# Altium project RbMotor_ECAT_RevB+.PrjPcb (part 1 of 2)
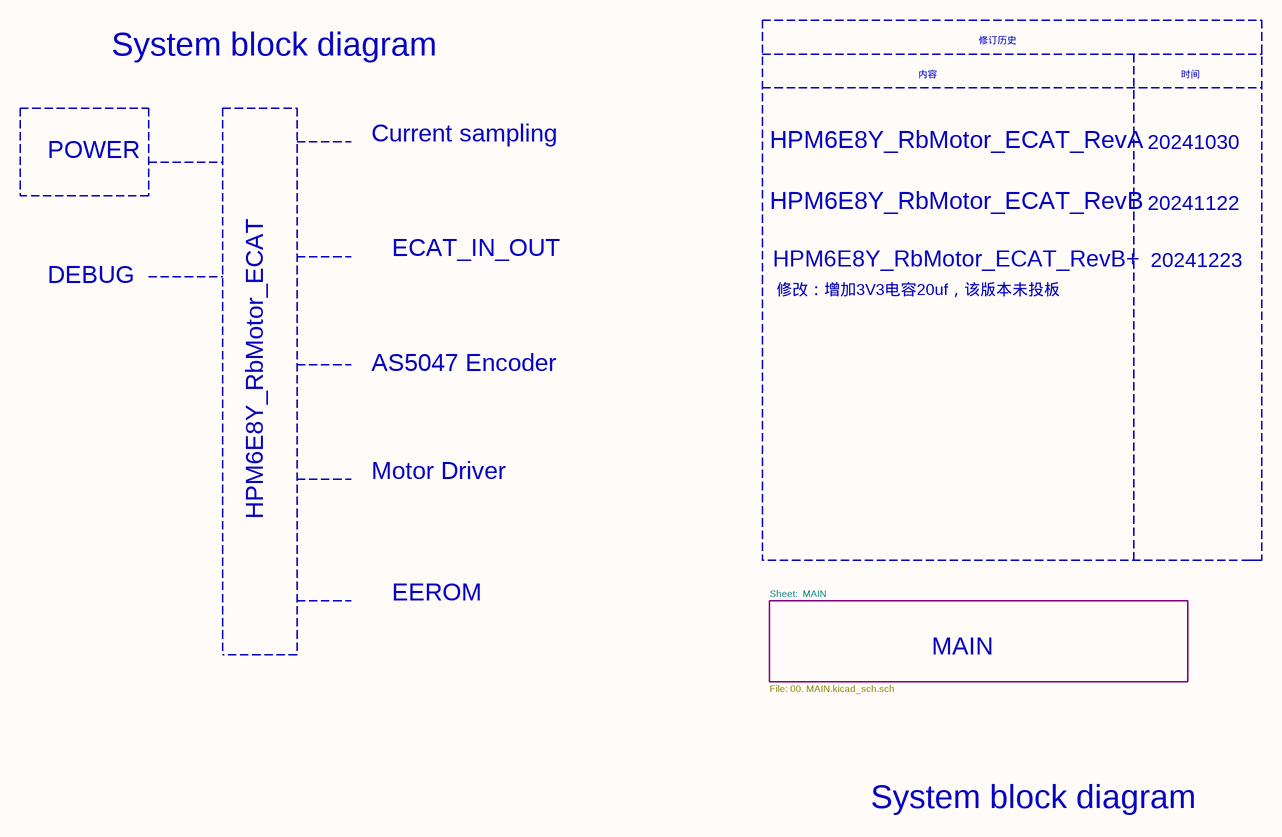
[diagram p0: RbMotor_ECAT_RevB+.SchDoc]
17 sheets, 286 parts. Net scope: flat (ports and power ports of the same name join across sheets).
Board file: RbMotor_ECAT_RevB+.PcbDoc
Sheets:
  RbMotor_ECAT_RevB+.SchDoc
     MAIN = 00. MAIN.SchDoc
      08.MCU_OSC = 08.MCU_OSC.SchDoc
      13.Motor DriverB = 13.Motor DriverB.SchDoc
      12.Motor DriverA = 12.Motor DriverA.SchDoc
      10.AS5047 Encoder = 10.AS5047 Encoder.SchDoc
      14.Motor DriverC = 14.Motor DriverC.SchDoc
      04.MCU_PB = 04.MCU_PB.SchDoc
      01.SYS_POWER = 01.SYS_POWER.SchDoc
      15.EEROM = 15.EEROM.SchDoc
      07.MCU_PE_PF = 07.MCU_PE_PF.SchDoc
      05.MCU_PC = 05.MCU_PC.SchDoc
      11.Current sampling = 11.Current sampling.SchDoc
      03.MCU_PA_JTAG = 03.MCU_PA_JTAG.SchDoc
      06.MCU_PD = 06.MCU_PD.SchDoc
      02.MCU_POWER = 02.MCU_POWER.SchDoc
      09.ECAT_IN_OUT = 09.ECAT_IN_OUT.SchDoc

## Sheet RbMotor_ECAT_RevB+.SchDoc
size 297 x 209 mm

### Sub-sheets
 MAIN = 00. MAIN.SchDoc: no entries

### Notes on the sheet
- System block diagram
- 内容
- 修订历史
- 时间
- POWER
- Current sampling
- HPM6E8Y_RbMotor_ECAT_RevA
- 20241030
- HPM6E8Y_RbMotor_ECAT_RevB
- 20241122
- DEBUG
- ECAT_IN_OUT
- HPM6E8Y_RbMotor_ECAT_RevB+
- 修改：增加3V3电容20uf，该版本未投板
- 20241223
- AS5047 Encoder
- Motor Driver
- HPM6E8Y_RbMotor_ECAT
- EEROM
- Sheet:  MAIN
- File: 00. MAIN.kicad_sch.sch
- MAIN
- 1
- 2
- 3
- 4
- 5
- 6
- A
- B
- C
- D
- Title: HPM6E8Y_RbMotor_ECAT
- File: RbMotor_ECAT_RevB+.kicad_sch
- Sheet: /
- KiCad E.D.A.  kicad (5.1.4)-1
- Size: A4
- Date: 2024-11-21
- Rev: RevB+
- Id: 1/1

## Sheet 00. MAIN.SchDoc
size 297 x 209 mm
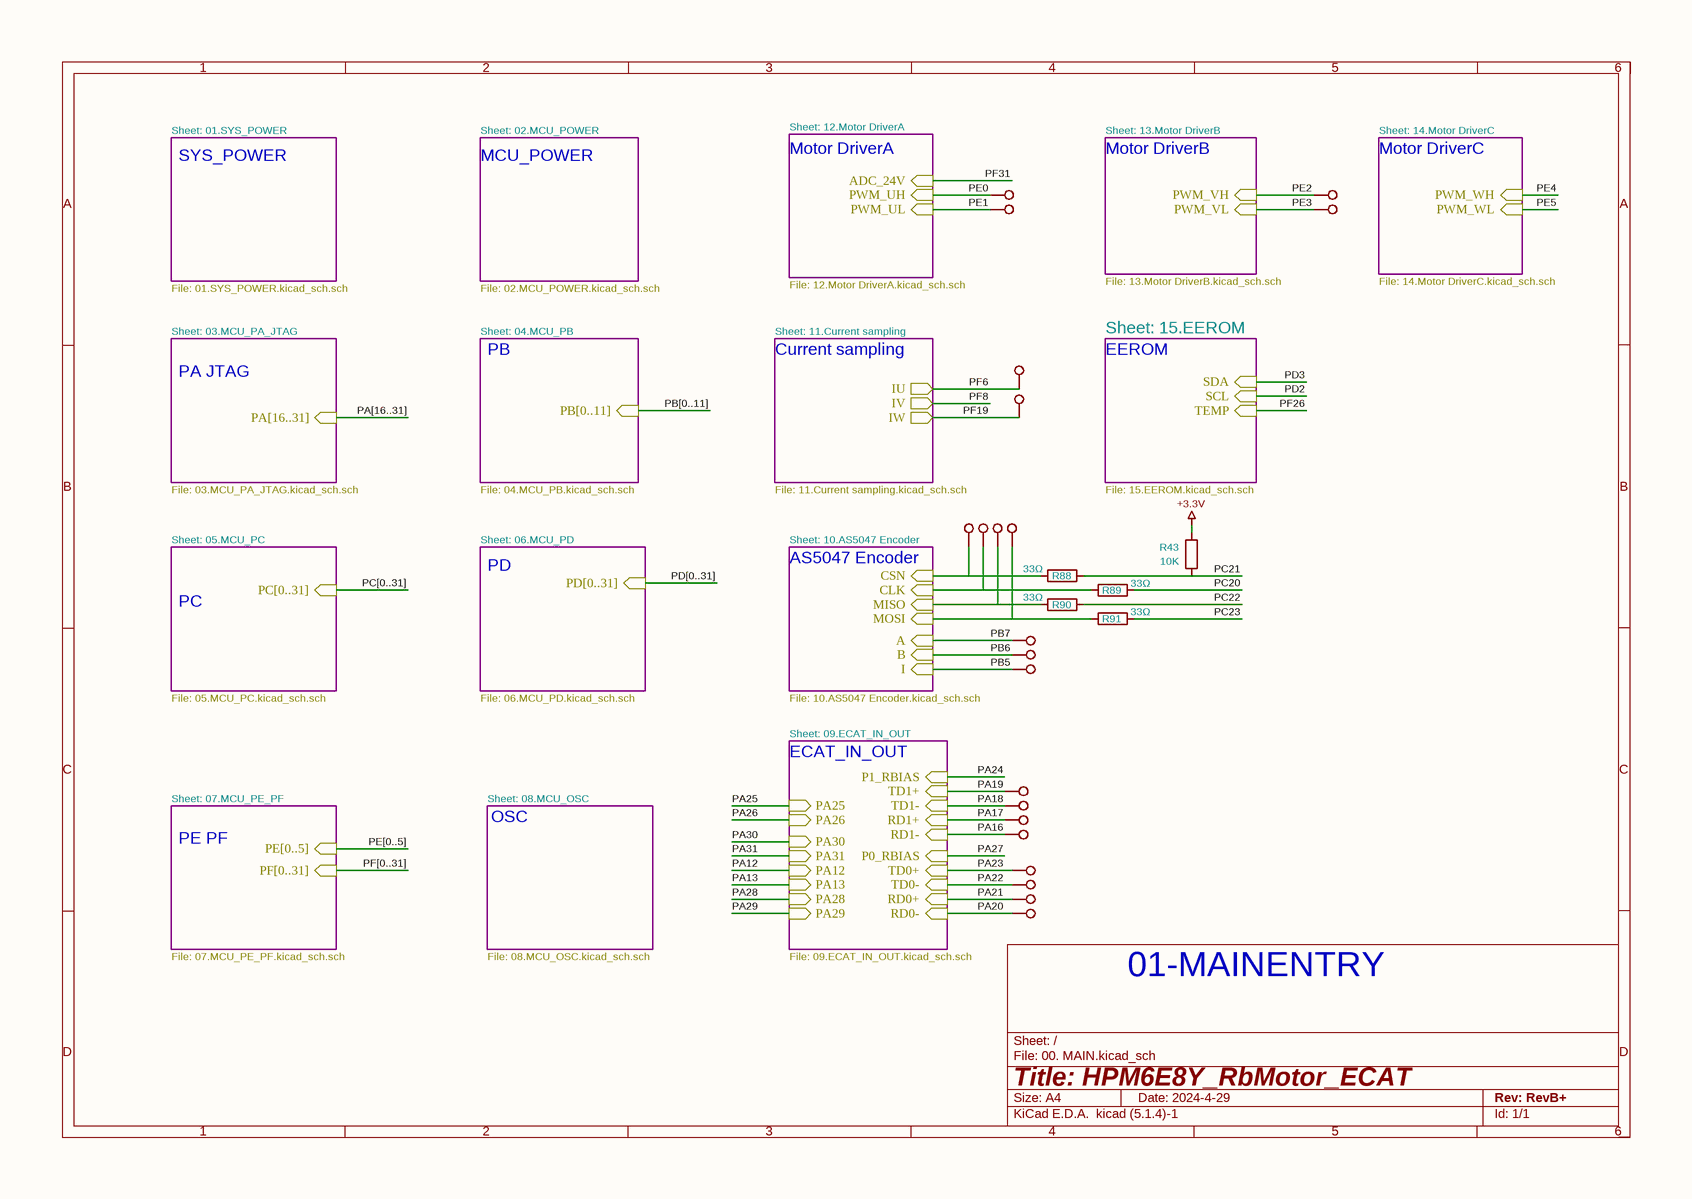
[diagram p1: 00. MAIN.SchDoc]

### Parts
R43  10K  [R_0402_1005Metric]
R88  33Ω  [R_0402_1005Metric]
R89  33Ω  [R_0402_1005Metric]
R90  33Ω  [R_0402_1005Metric]
R91  33Ω  [R_0402_1005Metric]
TP2  0.5mm  [TestPoint_Pad_D0.5mm]  (value not drawn)
TP3  0.5mm  [TestPoint_Pad_D0.5mm]  (value not drawn)
TP9  0.5mm  [TestPoint_Pad_D0.5mm]  (value not drawn)
TP12  0.5mm  [TestPoint_Pad_D0.5mm]  (value not drawn)
TP13  0.5mm  [TestPoint_Pad_D0.5mm]  (value not drawn)
TP15  0.5mm  [TestPoint_Pad_D0.5mm]  (value not drawn)
TP18  0.5mm  [TestPoint_Pad_D0.5mm]  (value not drawn)
TP19  0.5mm  [TestPoint_Pad_D0.5mm]  (value not drawn)
TP20  0.5mm  [TestPoint_Pad_D0.5mm]  (value not drawn)
TP21  0.5mm  [TestPoint_Pad_D0.5mm]  (value not drawn)
TP22  0.5mm  [TestPoint_Pad_D0.5mm]  (value not drawn)
TP23  0.5mm  [TestPoint_Pad_D0.5mm]  (value not drawn)
TP24  0.5mm  [TestPoint_Pad_D0.5mm]  (value not drawn)
TP25  0.5mm  [TestPoint_Pad_D0.5mm]  (value not drawn)
TP26  0.5mm  [TestPoint_Pad_D0.5mm]  (value not drawn)
TP27  0.5mm  [TestPoint_Pad_D0.5mm]  (value not drawn)
TP28  0.5mm  [TestPoint_Pad_D0.5mm]  (value not drawn)
TP29  0.5mm  [TestPoint_Pad_D0.5mm]  (value not drawn)
TP30  0.5mm  [TestPoint_Pad_D0.5mm]  (value not drawn)
TP31  0.5mm  [TestPoint_Pad_D0.5mm]  (value not drawn)
TP32  0.5mm  [TestPoint_Pad_D0.5mm]  (value not drawn)

### Sub-sheets
01.SYS_POWER = 01.SYS_POWER.SchDoc: no entries
02.MCU_POWER = 02.MCU_POWER.SchDoc: no entries
03.MCU_PA_JTAG = 03.MCU_PA_JTAG.SchDoc: PA[16..31] (in)
04.MCU_PB = 04.MCU_PB.SchDoc: PB[0..11] (in)
05.MCU_PC = 05.MCU_PC.SchDoc: PC[0..31] (in)
06.MCU_PD = 06.MCU_PD.SchDoc: PD[0..31] (in)
07.MCU_PE_PF = 07.MCU_PE_PF.SchDoc: PF[0..31] (in), PE[0..5] (in)
08.MCU_OSC = 08.MCU_OSC.SchDoc: no entries
09.ECAT_IN_OUT = 09.ECAT_IN_OUT.SchDoc: P1_RBIAS (in), PA30 (in), PA31 (in), PA12 (in), PA13 (in), TD1+ (in), TD1- (in), RD1+ (in), RD1- (in), RD0- (in), RD0+ (in), TD0- (in), TD0+ (in), P0_RBIAS (in), PA25 (in), PA26 (in), PA29 (in), PA28 (in)
10.AS5047 Encoder = 10.AS5047 Encoder.SchDoc: CLK (in), MISO (in), CSN (in), MOSI (in), I (in), B (in), A (in)
11.Current sampling = 11.Current sampling.SchDoc: IU (out), IV (out), IW (out)
12.Motor DriverA = 12.Motor DriverA.SchDoc: PWM_UH (in), PWM_UL (in), ADC_24V (in)
13.Motor DriverB = 13.Motor DriverB.SchDoc: PWM_VL (in), PWM_VH (in)
14.Motor DriverC = 14.Motor DriverC.SchDoc: PWM_WH (in), PWM_WL (in)
15.EEROM = 15.EEROM.SchDoc: SCL (in), SDA (in), TEMP (in)

### Nets
+3.3V: R43.2
PA12: sheet 09.ECAT_IN_OUT/PA12
PA13: sheet 09.ECAT_IN_OUT/PA13
PA16: TP25.1 ; sheet 09.ECAT_IN_OUT/RD1-
PA17: TP24.1 ; sheet 09.ECAT_IN_OUT/RD1+
PA18: TP23.1 ; sheet 09.ECAT_IN_OUT/TD1-
PA19: TP22.1 ; sheet 09.ECAT_IN_OUT/TD1+
PA20: TP29.1 ; sheet 09.ECAT_IN_OUT/RD0-
PA21: TP28.1 ; sheet 09.ECAT_IN_OUT/RD0+
PA22: TP27.1 ; sheet 09.ECAT_IN_OUT/TD0-
PA23: TP26.1 ; sheet 09.ECAT_IN_OUT/TD0+
PA24: sheet 09.ECAT_IN_OUT/P1_RBIAS
PA25: sheet 09.ECAT_IN_OUT/PA25
PA26: sheet 09.ECAT_IN_OUT/PA26
PA27: sheet 09.ECAT_IN_OUT/P0_RBIAS
PA28: sheet 09.ECAT_IN_OUT/PA28
PA29: sheet 09.ECAT_IN_OUT/PA29
PA30: sheet 09.ECAT_IN_OUT/PA30
PA31: sheet 09.ECAT_IN_OUT/PA31
PA[16..31]: sheet 03.MCU_PA_JTAG/PA[16..31]
PB5: TP32.1 ; sheet 10.AS5047 Encoder/I
PB6: TP31.1 ; sheet 10.AS5047 Encoder/B
PB7: TP30.1 ; sheet 10.AS5047 Encoder/A
PB[0..11]: sheet 04.MCU_PB/PB[0..11]
PC20: R89.2
PC21: R43.1 R88.2
PC22: R90.2
PC23: R91.2
PC[0..31]: sheet 05.MCU_PC/PC[0..31]
PD2: sheet 15.EEROM/SCL
PD3: sheet 15.EEROM/SDA
PD[0..31]: sheet 06.MCU_PD/PD[0..31]
PE0: TP12.1 ; sheet 12.Motor DriverA/PWM_UH
PE1: TP13.1 ; sheet 12.Motor DriverA/PWM_UL
PE2: TP2.1 ; sheet 13.Motor DriverB/PWM_VH
PE3: TP9.1 ; sheet 13.Motor DriverB/PWM_VL
PE4: sheet 14.Motor DriverC/PWM_WH
PE5: sheet 14.Motor DriverC/PWM_WL
PE[0..5]: sheet 07.MCU_PE_PF/PE[0..5]
PF6: TP3.1 ; sheet 11.Current sampling/IU
PF8: sheet 11.Current sampling/IV
PF19: TP15.1 ; sheet 11.Current sampling/IW
PF26: sheet 15.EEROM/TEMP
PF31: sheet 12.Motor DriverA/ADC_24V
PF[0..31]: sheet 07.MCU_PE_PF/PF[0..31]
NetR88_1: R88.1 TP18.1 ; sheet 10.AS5047 Encoder/CSN
NetR89_1: R89.1 TP19.1 ; sheet 10.AS5047 Encoder/CLK
NetR90_1: R90.1 TP20.1 ; sheet 10.AS5047 Encoder/MISO
NetR91_1: R91.1 TP21.1 ; sheet 10.AS5047 Encoder/MOSI

### Notes on the sheet
- Sheet: 01.SYS_POWER
- Sheet: 02.MCU_POWER
- Sheet: 12.Motor DriverA
- Sheet: 13.Motor DriverB
- Sheet: 14.Motor DriverC
- SYS_POWER
- MCU_POWER
- Motor DriverA
- Motor DriverB
- Motor DriverC
- File: 01.SYS_POWER.kicad_sch.sch
- File: 02.MCU_POWER.kicad_sch.sch
- File: 12.Motor DriverA.kicad_sch.sch
- File: 13.Motor DriverB.kicad_sch.sch
- File: 14.Motor DriverC.kicad_sch.sch
- Sheet: 03.MCU_PA_JTAG
- Sheet: 04.MCU_PB
- PB
- Sheet: 11.Current sampling
- Current sampling
- Sheet: 15.EEROM
- EEROM
- PA
  JTAG
- File: 03.MCU_PA_JTAG.kicad_sch.sch
- File: 04.MCU_PB.kicad_sch.sch
- File: 11.Current sampling.kicad_sch.sch
- (near R43) File: 15.EEROM.kicad_sch.sch
- Sheet: 05.MCU_PC
- Sheet: 06.MCU_PD
- PD
- Sheet: 10.AS5047 Encoder
- AS5047 Encoder
- PC
- File: 05.MCU_PC.kicad_sch.sch
- File: 06.MCU_PD.kicad_sch.sch
- File: 10.AS5047 Encoder.kicad_sch.sch
- Sheet: 09.ECAT_IN_OUT
- ECAT_IN_OUT
- Sheet: 07.MCU_PE_PF
- PE
  PF
- Sheet: 08.MCU_OSC
- OSC
- File: 07.MCU_PE_PF.kicad_sch.sch
- File: 08.MCU_OSC.kicad_sch.sch
- File: 09.ECAT_IN_OUT.kicad_sch.sch
- 01-MAINENTRY
- 1
- 2
- 3
- 4
- 5
- 6
- A
- B
- C
- D
- Title: HPM6E8Y_RbMotor_ECAT
- File: 00. MAIN.kicad_sch
- Sheet: /
- KiCad E.D.A.  kicad (5.1.4)-1
- Size: A4
- Date: 2024-4-29
- Rev: RevB+
- Id: 1/1

### Library data of the parts
R43 = 10K_0402: Model: 0402WGF1002TCE; Company: UNI-ROYAL(厚声); Value: 10K; Footprint: 02_HPM_Resistor:R_0402_1005Metric
R88-R91 = 33Ω_0402: Model: 0402WGF330JTCE; Company: UNI-ROYAL(厚声); Value: 33Ω; Footprint: 02_HPM_Resistor:R_0402_1005Metric
TP2 TP3 TP9 TP12 TP13 TP15 TP18-TP32 = TestPoint-0.5mm: Value: 0.5mm; Footprint: 01_HPM_Peripheral:TestPoint_Pad_D0.5mm

## Sheet 08.MCU_OSC.SchDoc
size 297 x 209 mm
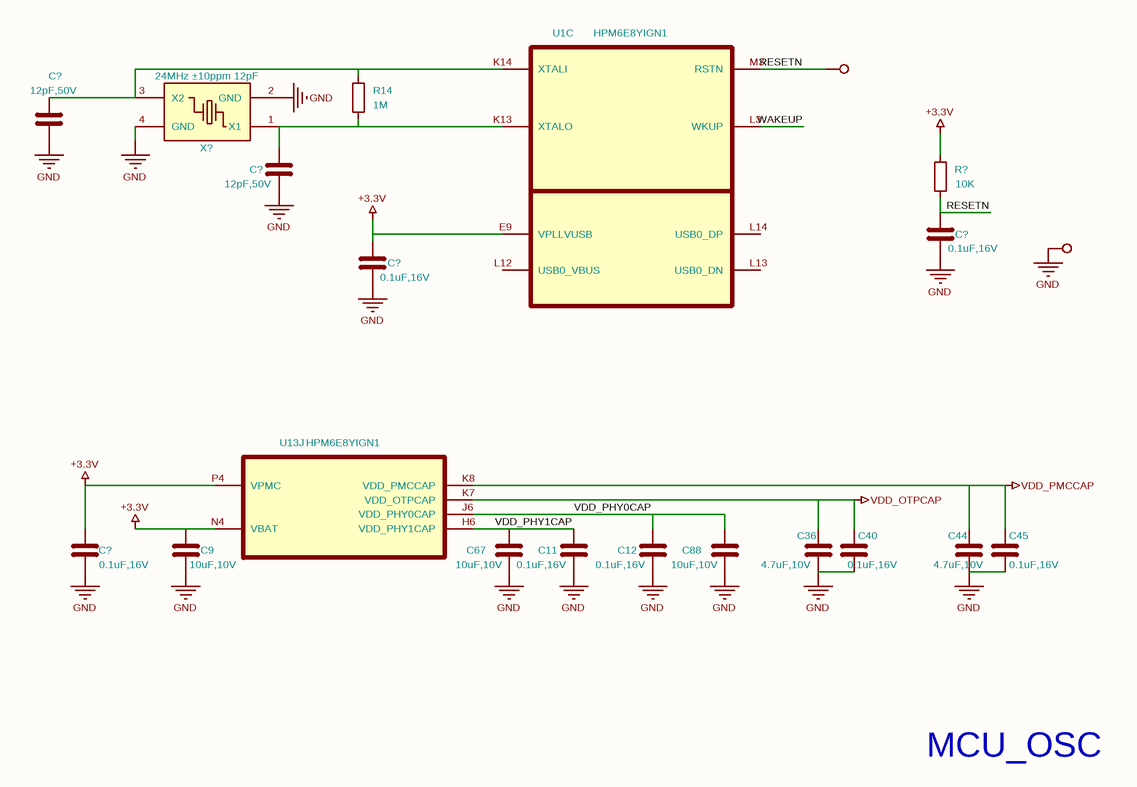
[diagram p2: 08.MCU_OSC.SchDoc]

### Parts
(Parts that share a designator on the sheet are numbered #1, #2 ... from top to bottom, then left to right.)
C9  10uF,10V  [C_0402]
C11#1  0.1uF,16V  [C_0402]
C12#1  0.1uF,16V  [C_0402]
C36#1  4.7uF,10V  [C_0402]
C40  0.1uF,16V  [C_0402]
C44  4.7uF,10V  [C_0402]
C45  0.1uF,16V  [C_0402]
C67  10uF,10V  [C_0402]
C88  10uF,10V  [C_0402]
C?#1  12pF,50V  [C_0402]
C?#2  12pF,50V  [C_0402]
C?#3  0.1uF,16V  [C_0402]
C?#4  0.1uF,16V  [C_0402]
C?#5  0.1uF,16V  [C_0402]
R14  1M  [R_0402_1005Metric]
R?#1  10K  [R_0402_1005Metric]
TP38#1  1.0mm  [TestPoint_1.5]  (value not drawn)
TP38#2  1.0mm  [TestPoint_1.5]  (value not drawn)
U1  HPM6E8YIGN1  [BGA-196_14x14_12.0x12.0mm_P0.8mm]  (part C of 10)
U13#1  HPM6E8YIGN1  [BGA-196_14x14_12.0x12.0mm_P0.8mm]  (part J of 10)
X?  24MHz ±10ppm 12pF  [3225]

### Nets
+3.3V: C9.1 C?#4.1 C?#5.2 R?#1.1 U1.E9(VPLLVUSB) U13#1.N4(VBAT) U13#1.P4(VPMC)
GND: C9.2 C11#1.2 C12#1.2 C36#1.2 C40.2 C44.2 C45.2 C67.2 C88.2 C?#1.2 C?#2.2 C?#3.2 C?#4.2 C?#5.1 TP38#2.1 X?.2(GND) X?.4(GND)
VDD_OTPCAP: C36#1.1 C40.1 U13#1.K7(VDD_OTPCAP)
VDD_PMCCAP: C44.1 C45.1 U13#1.K8(VDD_PMCCAP)
RESETN: C?#3.1 R?#1.2 TP38#1.1 U1.M3(RSTN)
VDD_PHY0CAP: C12#1.1 C88.1 U13#1.J6(VDD_PHY0CAP)
VDD_PHY1CAP: C11#1.1 C67.1 U13#1.H6(VDD_PHY1CAP)
WAKEUP: U1.L3(WKUP)
NetC?#1_1: C?#1.1 R14.2 U1.K14(XTALI) X?.3(X2)
NetC?#2_1: C?#2.1 R14.1 U1.K13(XTALO) X?.1(X1)

Not connected (* = marked no-connect by the designer): U1 L12(USB0_VBUS) L13(USB0_DN) L14(USB0_DP)

### Notes on the sheet
- MCU_OSC
- 1
- 2
- 3
- 4
- 5
- 6
- A
- B
- C
- D
- Title: HPM6E8Y_RbMotor_ECAT
- File: 08.MCU_OSC.kicad_sch
- Sheet: /
- KiCad E.D.A.  kicad (5.1.4)-1
- Size: A4
- Date: 2023-12-28
- Rev: RevB+
- Id: 1/1

### Library data of the parts
C9 C67 C88 = 10uF,10V_0402: Model: CL05A106MP5NUNC; Company: SAMSUNG(三星); Value: 10uF,10V; Footprint: 03_HPM_Capacitance:C_0402
C11#1 = 0.1uF,16V_0402_2: Model: CL05B104KO5NNNC; Company: SAMSUNG(三星); Value: 0.1uF,16V; Footprint: 03_HPM_Capacitance:C_0402
C12#1 C?#3 = 0.1uF,16V_0402_1: Model: CL05B104KO5NNNC; Company: SAMSUNG(三星); Value: 0.1uF,16V; Footprint: 03_HPM_Capacitance:C_0402
C36#1 = 4.7uF,10V_0402: Model: CL05A475MP5NRNC; Company: SAMSUNG(三星); Value: 4.7uF,10V; Footprint: 03_HPM_Capacitance:C_0402
C40 = 0.1uF,16V_0402_4: Model: CL05B104KO5NNNC; Company: SAMSUNG(三星); Value: 0.1uF,16V; Footprint: 03_HPM_Capacitance:C_0402
C44 = 4.7uF,10V_0402_1: Model: CL05A475MP5NRNC; Company: SAMSUNG(三星); Value: 4.7uF,10V; Footprint: 03_HPM_Capacitance:C_0402
C45 = 0.1uF,16V_0402_5: Model: CL05B104KO5NNNC; Company: SAMSUNG(三星); Value: 0.1uF,16V; Footprint: 03_HPM_Capacitance:C_0402
C?#1 = 12pF,50V_0402_1: Model: CC0402JRNPO9BN120; Company: YAGEO(国巨); Value: 12pF,50V; Footprint: 03_HPM_Capacitance:C_0402
C?#2 = 12pF,50V_0402: Model: CC0402JRNPO9BN120; Company: YAGEO(国巨); Value: 12pF,50V; Footprint: 03_HPM_Capacitance:C_0402
C?#4 = 0.1uF,16V_0402_3: Model: CL05B104KO5NNNC; Company: SAMSUNG(三星); Value: 0.1uF,16V; Footprint: 03_HPM_Capacitance:C_0402
C?#5 = 0.1uF,16V_0402: Model: CL05B104KO5NNNC; Company: SAMSUNG(三星); Value: 0.1uF,16V; Footprint: 03_HPM_Capacitance:C_0402
R14 = 1M_0402: Model: CQ02WGJ0105TCE; Company: UNI-ROYAL(厚声); Value: 1M; Footprint: 02_HPM_Resistor:R_0402_1005Metric
R?#1 = 10K_0402: as R43 on sheet 00. MAIN; Value: 10K; Footprint: 02_HPM_Resistor:R_0402_1005Metric
TP38#1 TP38#2 = TestPoint-1.0mm: Value: 1.0mm; Footprint: 01_HPM_Peripheral:TestPoint_1.5
X? = 24MHz ±10ppm 12pF: Model: X1E0000210129; Company: EPSON(爱普生); Value: 24MHz ±10ppm 12pF; Footprint: 09_HPM_Oscillator:3225
U1 U13#1 = HPM6E8YIGN1: Value: HPM6E8YIGN1; Footprint: 00_HPM_Library:BGA-196_14x14_12.0x12.0mm_P0.8mm

## Sheet 13.Motor DriverB.SchDoc
size 297 x 209 mm
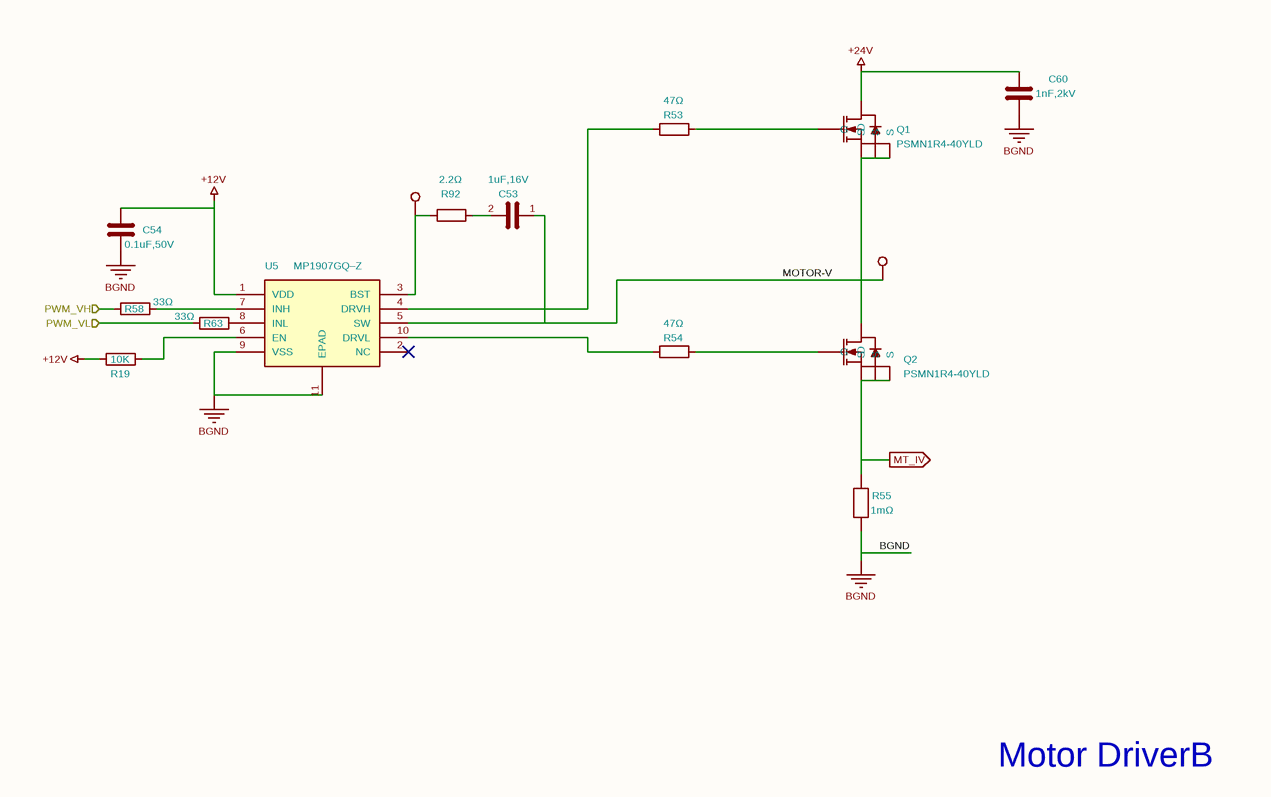
[diagram p3: 13.Motor DriverB.SchDoc]

### Parts
(Parts that share a designator on the sheet are numbered #1, #2 ... from top to bottom, then left to right.)
C53#1  1uF,16V  [C_0603_1608Metric]
C54#1  0.1uF,50V  [C_0603_1608Metric]
C60#1  1nF,2kV  [C_1206_3216Metric]
Q1#1  PSMN1R4-40YLD  [sot_669_2]
Q2#1  PSMN1R4-40YLD  [sot_669_2]
R19#1  10K  [R_0402_1005Metric]
R53#1  47Ω  [R_0603_1608Metric]
R54#1  47Ω  [R_0603_1608Metric]
R55#1  1mΩ  [R2010]
R58#1  33Ω  [R_0402_1005Metric]
R63#1  33Ω  [R_0402_1005Metric]
R92#1  2.2Ω  [R_0603_1608Metric]
TP4#1  0.5mm  [SMD_3mm_Pad]  (value not drawn)
TP16#1  0.5mm  [TestPoint_Pad_D0.5mm]  (value not drawn)
U5#1  MP1907GQ–Z  [QFN-10_L3.0-W3.0-P0.50-LS3.0-BL-EP]

### Ports
MT_IV (out), PWM_VH (in), PWM_VL (in)

### Nets
+12V: C54#1.1 R19#1.1 U5#1.1(VDD)
+24V: C60#1.1 Q1#1.5(D)
BGND: C54#1.2 C60#1.2 R55#1.1 U5#1.9(VSS) U5#1.11(EPAD)
MOTOR-V: C53#1.1 Q1#1.1(S) Q1#1.2(S) Q1#1.3(S) Q2#1.5(D) TP4#1.1 U5#1.5(SW)
MT_IV: Q2#1.1(S) Q2#1.2(S) Q2#1.3(S) R55#1.2 ; port MT_IV
PWM_VH: R58#1.1 ; port PWM_VH
PWM_VL: R63#1.1 ; port PWM_VL
NetC53#1_2: C53#1.2 R92#1.2
NetQ1#1_4: Q1#1.4(G) R53#1.2
NetQ2#1_4: Q2#1.4(G) R54#1.2
NetR19#1_2: R19#1.2 U5#1.6(EN)
NetR53#1_1: R53#1.1 U5#1.4(DRVH)
NetR54#1_1: R54#1.1 U5#1.10(DRVL)
NetR58#1_2: R58#1.2 U5#1.7(INH)
NetR63#1_2: R63#1.2 U5#1.8(INL)
NetR92#1_1: R92#1.1 TP16#1.1 U5#1.3(BST)

Not connected (* = marked no-connect by the designer): U5#1 2(NC)*

### Notes on the sheet
- Motor DriverB
- 1
- 2
- 3
- 4
- 5
- 6
- A
- B
- C
- D
- Title: HPM6E8Y_RbMotor_ECAT
- File: 13.Motor DriverB.kicad_sch
- Sheet: /
- KiCad E.D.A.  kicad (5.1.4)-1
- Size: A4
- Date:
- Rev: RevB+
- Id: 1/1

### Library data of the parts
C53#1 = 1uF,16V_0603: Model: CL10A105KO8NNNC; Company: SAMSUNG(三星); Value: 1uF,16V; Footprint: 03_HPM_Capacitance:C_0603_1608Metric
C54#1 = 0.1uF,50V,0603: Model: CC0603JRX7R9BB104; Company: YAGEO; Value: 0.1uF,50V; Footprint: 03_HPM_Capacitance:C_0603_1608Metric
C60#1 = 1nF,2kV_1206: Model: 1206B102K202NT; Company: FH(风华); Value: 1nF,2kV; Footprint: 03_HPM_Capacitance:C_1206_3216Metric
Q1#1 = PSMN1R4-40YLD_1: Company: Nexperia(安世); Model: PSMN1R4-40YLD; Value: PSMN1R4-40YLD; Footprint: 13_ower:sot_669_2
Q2#1 = PSMN1R4-40YLD: Company: Nexperia(安世); Model: PSMN1R4-40YLD; Value: PSMN1R4-40YLD; Footprint: 13_ower:sot_669_2
R19#1 = 10K_0402: as R43 on sheet 00. MAIN; Value: 10K; Footprint: 02_HPM_Resistor:R_0402_1005Metric
R53#1 R54#1 = 47Ω_0603: Model: 0603WAF470JT5E; Company: UNI-ROYAL(厚声); Value: 47Ω; Footprint: 02_HPM_Resistor:R_0603_1608Metric
R55#1 = 10mΩ_2512: Model: HoLR2010-1W-1mR-1%; Company: Milliohm(毫欧); Value: 1mΩ; Footprint: 13_ower:R2010
R58#1 R63#1 = 33Ω_0402: as R88 on sheet 00. MAIN; Value: 33Ω; Footprint: 02_HPM_Resistor:R_0402_1005Metric
R92#1 = 2.2Ω_0603: Model: 0603WAF220KT5E; Company: UNI-ROYAL(厚声); Value: 2.2Ω; Footprint: 02_HPM_Resistor:R_0603_1608Metric
TP4#1 TP16#1 = TestPoint-0.5mm: Value: 0.5mm
  TP4#1: Footprint: 01_HPM_Peripheral:SMD_3mm_Pad
  TP16#1: Footprint: 01_HPM_Peripheral:TestPoint_Pad_D0.5mm
U5#1 = MP1907GQ–Z: Value: MP1907GQ–Z; Footprint: 06_HPM_LQFP:QFN-10_L3.0-W3.0-P0.50-LS3.0-BL-EP

## Sheet 12.Motor DriverA.SchDoc
size 297 x 209 mm
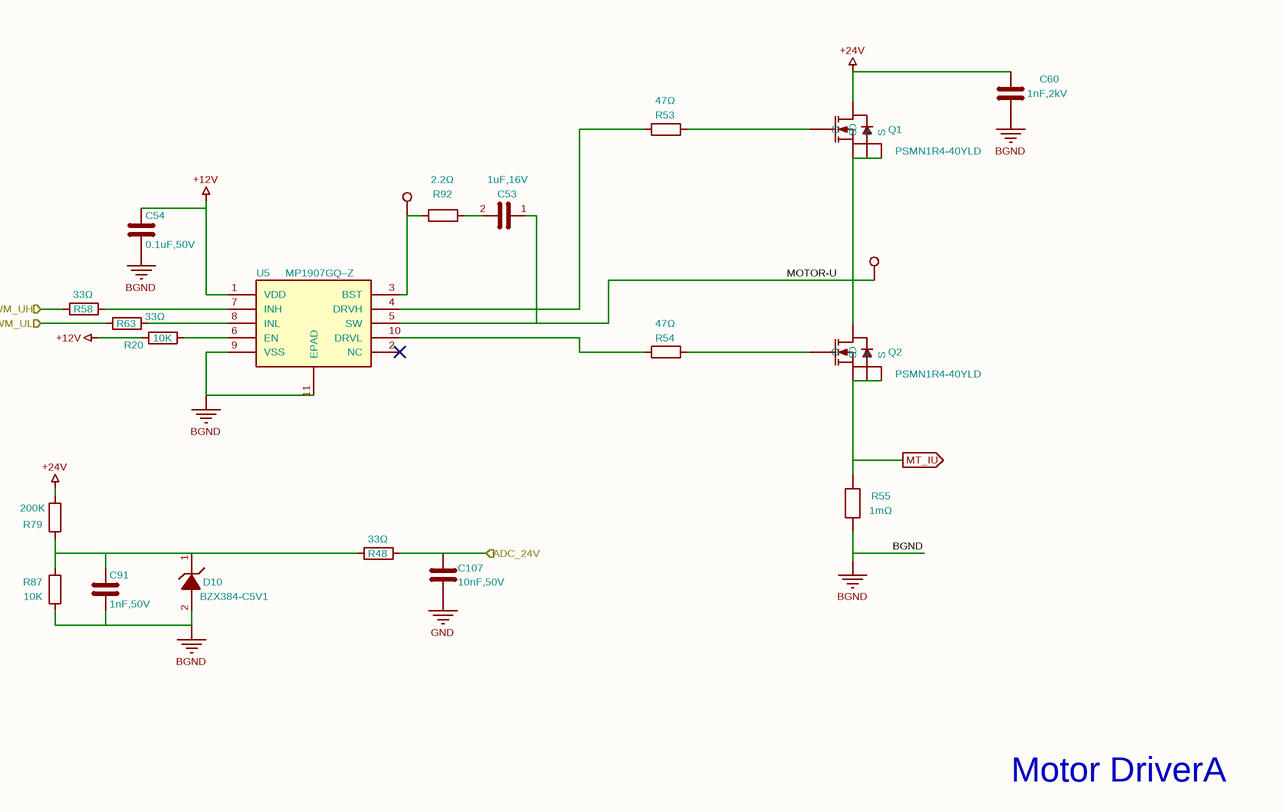
[diagram p4: 12.Motor DriverA.SchDoc]

### Parts
(Parts that share a designator on the sheet are numbered #1, #2 ... from top to bottom, then left to right.)
C53#2  1uF,16V  [C_0603_1608Metric]
C54#2  0.1uF,50V  [C_0603_1608Metric]
C60#2  1nF,2kV  [C_1206_3216Metric]
C91#1  1nF,50V  [C_0402_1005Metric]
C107  10nF,50V  [C_0402_1005Metric]
D10  BZX384-C5V1  [SOD-323]
Q1#2  PSMN1R4-40YLD  [sot_669_2]
Q2#2  PSMN1R4-40YLD  [sot_669_2]
R20  10K  [R_0402_1005Metric]
R48#1  33Ω  [R_0402_1005Metric]
R53#2  47Ω  [R_0603_1608Metric]
R54#2  47Ω  [R_0603_1608Metric]
R55#2  1mΩ  [R2010]
R58#2  33Ω  [R_0402_1005Metric]
R63#2  33Ω  [R_0402_1005Metric]
R79  200K  [R_0402_1005Metric]
R87  10K  [R_0603_1608Metric]
R92#2  2.2Ω  [R_0603_1608Metric]
TP4#2  0.5mm  [SMD_3mm_Pad]  (value not drawn)
TP16#2  0.5mm  [TestPoint_Pad_D0.5mm]  (value not drawn)
U5#2  MP1907GQ–Z  [QFN-10_L3.0-W3.0-P0.50-LS3.0-BL-EP]

### Ports
ADC_24V (in), MT_IU (out), PWM_UH (in), PWM_UL (in)

### Nets
+12V: C54#2.1 R20.1 U5#2.1(VDD)
+24V: C60#2.1 Q1#2.5(D) R79.2
BGND: C54#2.2 C60#2.2 C91#1.2 D10.2(A) R55#2.1 R87.1 U5#2.9(VSS) U5#2.11(EPAD)
GND: C107.2
ADC_24V: C107.1 R48#1.2 ; port ADC_24V
MOTOR-U: C53#2.1 Q1#2.1(S) Q1#2.2(S) Q1#2.3(S) Q2#2.5(D) TP4#2.1 U5#2.5(SW)
MT_IU: Q2#2.1(S) Q2#2.2(S) Q2#2.3(S) R55#2.2 ; port MT_IU
PWM_UH: R58#2.1 ; port PWM_UH
PWM_UL: R63#2.1 ; port PWM_UL
NetC53#2_2: C53#2.2 R92#2.2
NetC91#1_1: C91#1.1 D10.1(C) R48#1.1 R79.1 R87.2
NetQ1#2_4: Q1#2.4(G) R53#2.2
NetQ2#2_4: Q2#2.4(G) R54#2.2
NetR20_2: R20.2 U5#2.6(EN)
NetR53#2_1: R53#2.1 U5#2.4(DRVH)
NetR54#2_1: R54#2.1 U5#2.10(DRVL)
NetR58#2_2: R58#2.2 U5#2.7(INH)
NetR63#2_2: R63#2.2 U5#2.8(INL)
NetR92#2_1: R92#2.1 TP16#2.1 U5#2.3(BST)

Not connected (* = marked no-connect by the designer): U5#2 2(NC)*

### Notes on the sheet
- Motor DriverA
- 1
- 2
- 3
- 4
- 5
- 6
- A
- B
- C
- D
- Title: HPM6E8Y_RbMotor_ECAT
- File: 12.Motor DriverA.kicad_sch
- Sheet: /
- KiCad E.D.A.  kicad (5.1.4)-1
- Size: A4
- Date:
- Rev: RevB+
- Id: 1/1

### Library data of the parts
C53#2 = 1uF,16V_0603: as C53#1 on sheet 13.Motor DriverB; Value: 1uF,16V; Footprint: 03_HPM_Capacitance:C_0603_1608Metric
C54#2 = 0.1uF,50V,0603: Model: CC0603JRX7R9BB104; Company: YAGEO; Value: 0.1uF,50V; Footprint: 03_HPM_Capacitance:C_0603_1608Metric
C60#2 = 1nF,2kV_1206: Model: 1206B102K202NT; Company: FH(风华); Value: 1nF,2kV; Footprint: 03_HPM_Capacitance:C_1206_3216Metric
C91#1 = 1nF,50V,0603: Model: CC0603JRX7R9BB102; Company: YAGEO; Value: 1nF,50V; Footprint: 03_HPM_Capacitance:C_0402_1005Metric
C107 = 10nF,50V_0402: Model: CL05B103KB5NNNC; Company: SAMSUNG(三星); Value: 10nF,50V; Footprint: 03_HPM_Capacitance:C_0402_1005Metric
D10 = BZX384-C11: Company: Nexperia(安世); Model: BZX384-C5V1; Value: BZX384-C5V1; Footprint: 06_HPM_SO:SOD-323
Q1#2 = PSMN1R4-40YLD: Company: Nexperia(安世); Model: PSMN1R4-40YLD; Value: PSMN1R4-40YLD; Footprint: 13_ower:sot_669_2
Q2#2 = PSMN1R4-40YLD_1: Company: Nexperia(安世); Model: PSMN1R4-40YLD; Value: PSMN1R4-40YLD; Footprint: 13_ower:sot_669_2
R20 = 10K_0402: as R43 on sheet 00. MAIN; Value: 10K; Footprint: 02_HPM_Resistor:R_0402_1005Metric
R48#1 R58#2 R63#2 = 33Ω_0402: as R88 on sheet 00. MAIN; Value: 33Ω; Footprint: 02_HPM_Resistor:R_0402_1005Metric
R53#2 R54#2 = 47Ω_0603: as R53#1 on sheet 13.Motor DriverB; Value: 47Ω; Footprint: 02_HPM_Resistor:R_0603_1608Metric
R55#2 = 10mΩ_2512: as R55#1 on sheet 13.Motor DriverB; Value: 1mΩ; Footprint: 13_ower:R2010
R79 = 200K_0402: Model: 0402WGF2003TCE; Company: UNI-ROYAL(厚声); Value: 200K; Footprint: 02_HPM_Resistor:R_0402_1005Metric
R87 = 10K_0603: Model: RC0603FR-0710KL\n; Company: YAGEO\n; Value: 10K; Footprint: 02_HPM_Resistor:R_0603_1608Metric
R92#2 = 2.2Ω_0603: as R92#1 on sheet 13.Motor DriverB; Value: 2.2Ω; Footprint: 02_HPM_Resistor:R_0603_1608Metric
TP4#2 TP16#2 = TestPoint-0.5mm: Value: 0.5mm
  TP4#2: Footprint: 01_HPM_Peripheral:SMD_3mm_Pad
  TP16#2: Footprint: 01_HPM_Peripheral:TestPoint_Pad_D0.5mm
U5#2 = MP1907GQ–Z: Value: MP1907GQ–Z; Footprint: 06_HPM_LQFP:QFN-10_L3.0-W3.0-P0.50-LS3.0-BL-EP

## Sheet 10.AS5047 Encoder.SchDoc
size 297 x 209 mm
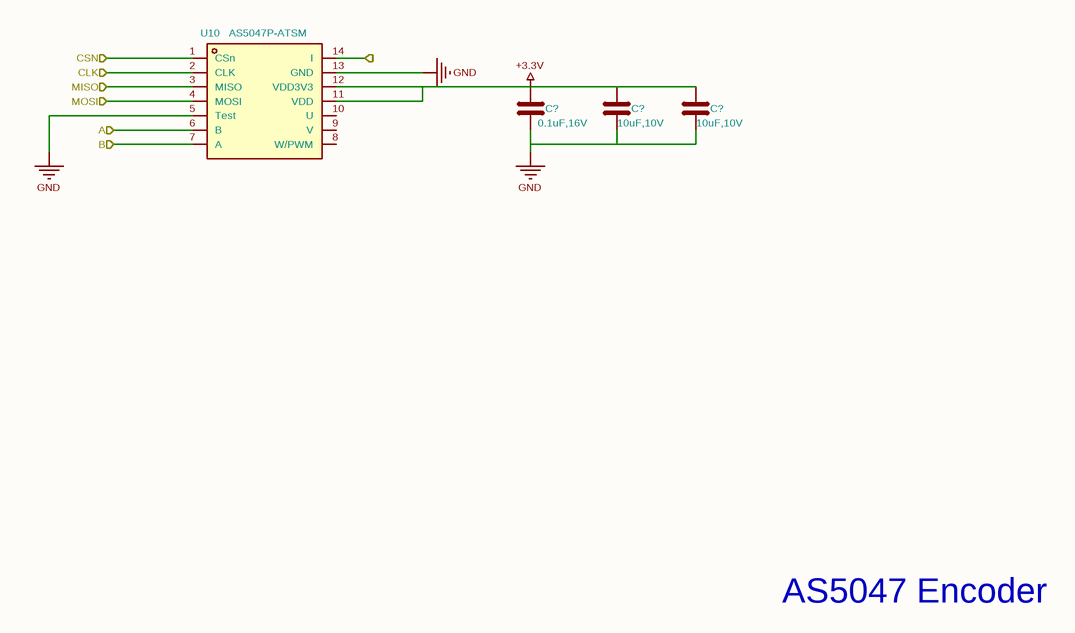
[diagram p5: 10.AS5047 Encoder.SchDoc]

### Parts
(Parts that share a designator on the sheet are numbered #1, #2 ... from top to bottom, then left to right.)
C?#6  0.1uF,16V  [C_0402]
C?#7  10uF,10V  [C_0402]
C?#8  10uF,10V  [C_0402]
U10  AS5047P-ATSM  [TSSOP-14_L5.0-W4.4-P0.65-LS6.4-BL]

### Ports
A (in), B (in), CLK (in), CSN (in), I (in), MISO (in), MOSI (in)

### Nets
+3.3V: C?#6.1 C?#7.1 C?#8.1 U10.11(VDD) U10.12(VDD3V3)
GND: C?#6.2 C?#7.2 C?#8.2 U10.5(Test) U10.13(GND)
A: U10.6(B) ; port A
B: U10.7(A) ; port B
CLK: U10.2(CLK) ; port CLK
CSN: U10.1(CSn) ; port CSN
I: U10.14(I) ; port I
MISO: U10.3(MISO) ; port MISO
MOSI: U10.4(MOSI) ; port MOSI

Not connected (* = marked no-connect by the designer): U10 8(W/PWM) 9(V) 10(U)

### Notes on the sheet
- AS5047 Encoder
- 1
- 2
- 3
- 4
- 5
- 6
- A
- B
- C
- D
- Title: HPM6E8Y_RbMotor_ECAT
- File: 10.AS5047 Encoder.kicad_sch
- Sheet: /
- KiCad E.D.A.  kicad (5.1.4)-1
- Size: A4
- Date:
- Rev: RevB+
- Id: 1/1

### Library data of the parts
C?#6 = 0.1uF,16V_0402_1: as C12#1 on sheet 08.MCU_OSC; Value: 0.1uF,16V; Footprint: 03_HPM_Capacitance:C_0402
C?#7 C?#8 = 10uF,10V_0402: as C9 on sheet 08.MCU_OSC; Value: 10uF,10V; Footprint: 03_HPM_Capacitance:C_0402
U10 = AS5047P-ATSM: Company: ams(艾迈斯半导体); SuppliersPartNumber: C962063; Model: AS5047P-ATSM; Value: AS5047P-ATSM; Footprint: 06_HPM_SO:TSSOP-14_L5.0-W4.4-P0.65-LS6.4-BL

## Sheet 14.Motor DriverC.SchDoc
size 297 x 209 mm
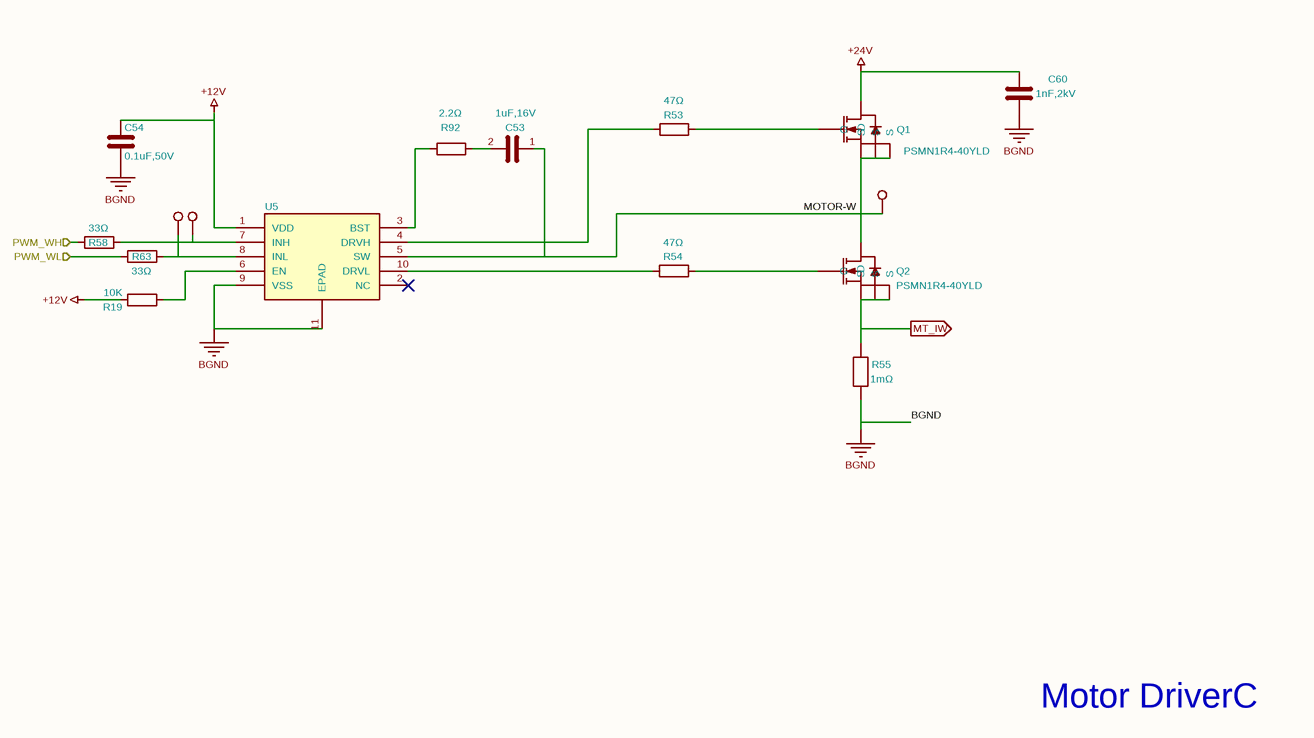
[diagram p6: 14.Motor DriverC.SchDoc]

### Parts
(Parts that share a designator on the sheet are numbered #1, #2 ... from top to bottom, then left to right.)
C53#3  1uF,16V  [C_0603_1608Metric]
C54#3  0.1uF,50V  [C_0603_1608Metric]
C60#3  1nF,2kV  [C_1206_3216Metric]
Q1#3  PSMN1R4-40YLD  [sot_669_2]
Q2#3  PSMN1R4-40YLD  [sot_669_2]
R19#2  10K  [R_0402_1005Metric]
R53#3  47Ω  [R_0603_1608Metric]
R54#3  47Ω  [R_0603_1608Metric]
R55#3  1mΩ  [R2010]
R58#3  33Ω  [R_0402_1005Metric]
R63#3  33Ω  [R_0402_1005Metric]
R92#3  2.2Ω  [R_0603_1608Metric]
TP4#3  0.5mm  [SMD_3mm_Pad]  (value not drawn)
TP10  0.5mm  [TestPoint_Pad_D0.5mm]  (value not drawn)
TP11  0.5mm  [TestPoint_Pad_D0.5mm]  (value not drawn)
U5#3  MP1907GQ–Z  [QFN-10_L3.0-W3.0-P0.50-LS3.0-BL-EP]  (value not drawn)

### Ports
MT_IW (out), PWM_WH (in), PWM_WL (in)

### Nets
+12V: C54#3.1 R19#2.1 U5#3.1(VDD)
+24V: C60#3.1 Q1#3.5(D)
BGND: C54#3.2 C60#3.2 R55#3.1 U5#3.9(VSS) U5#3.11(EPAD)
MOTOR-W: C53#3.1 Q1#3.1(S) Q1#3.2(S) Q1#3.3(S) Q2#3.5(D) TP4#3.1 U5#3.5(SW)
MT_IW: Q2#3.1(S) Q2#3.2(S) Q2#3.3(S) R55#3.2 ; port MT_IW
PWM_WH: R58#3.1 ; port PWM_WH
PWM_WL: R63#3.1 ; port PWM_WL
NetC53#3_2: C53#3.2 R92#3.2
NetQ1#3_4: Q1#3.4(G) R53#3.2
NetQ2#3_4: Q2#3.4(G) R54#3.2
NetR19#2_2: R19#2.2 U5#3.6(EN)
NetR53#3_1: R53#3.1 U5#3.4(DRVH)
NetR54#3_1: R54#3.1 U5#3.10(DRVL)
NetR58#3_2: R58#3.2 TP10.1 U5#3.7(INH)
NetR63#3_2: R63#3.2 TP11.1 U5#3.8(INL)
NetR92#3_1: R92#3.1 U5#3.3(BST)

Not connected (* = marked no-connect by the designer): U5#3 2(NC)*

### Notes on the sheet
- Motor DriverC
- 1
- 2
- 3
- 4
- 5
- 6
- A
- B
- C
- D
- Title: HPM6E8Y_RbMotor_ECAT
- File: 14.Motor DriverC.kicad_sch
- Sheet: /
- KiCad E.D.A.  kicad (5.1.4)-1
- Size: A4
- Date:
- Rev: RevB+
- Id: 1/1

### Library data of the parts
C53#3 = 1uF,16V_0603: as C53#1 on sheet 13.Motor DriverB; Value: 1uF,16V; Footprint: 03_HPM_Capacitance:C_0603_1608Metric
C54#3 = 0.1uF,50V,0603: Model: CC0603JRX7R9BB104; Company: YAGEO; Value: 0.1uF,50V; Footprint: 03_HPM_Capacitance:C_0603_1608Metric
C60#3 = 1nF,2kV_1206: Model: 1206B102K202NT; Company: FH(风华); Value: 1nF,2kV; Footprint: 03_HPM_Capacitance:C_1206_3216Metric
Q1#3 = PSMN1R4-40YLD: Company: Nexperia(安世); Model: PSMN1R4-40YLD; Value: PSMN1R4-40YLD; Footprint: 13_ower:sot_669_2
Q2#3 = PSMN1R4-40YLD_1: Company: Nexperia(安世); Model: PSMN1R4-40YLD; Value: PSMN1R4-40YLD; Footprint: 13_ower:sot_669_2
R19#2 = 10K_0402: as R43 on sheet 00. MAIN; Value: 10K; Footprint: 02_HPM_Resistor:R_0402_1005Metric
R53#3 R54#3 = 47Ω_0603: as R53#1 on sheet 13.Motor DriverB; Value: 47Ω; Footprint: 02_HPM_Resistor:R_0603_1608Metric
R55#3 = 10mΩ_2512: as R55#1 on sheet 13.Motor DriverB; Value: 1mΩ; Footprint: 13_ower:R2010
R58#3 R63#3 = 33Ω_0402: as R88 on sheet 00. MAIN; Value: 33Ω; Footprint: 02_HPM_Resistor:R_0402_1005Metric
R92#3 = 2.2Ω_0603: as R92#1 on sheet 13.Motor DriverB; Value: 2.2Ω; Footprint: 02_HPM_Resistor:R_0603_1608Metric
TP4#3 TP10 TP11 = TestPoint-0.5mm: Value: 0.5mm
  TP4#3: Footprint: 01_HPM_Peripheral:SMD_3mm_Pad
  TP10 TP11: Footprint: 01_HPM_Peripheral:TestPoint_Pad_D0.5mm
U5#3 = MP1907GQ–Z: Value: MP1907GQ–Z; Footprint: 06_HPM_LQFP:QFN-10_L3.0-W3.0-P0.50-LS3.0-BL-EP

## Sheet 04.MCU_PB.SchDoc
size 297 x 209 mm
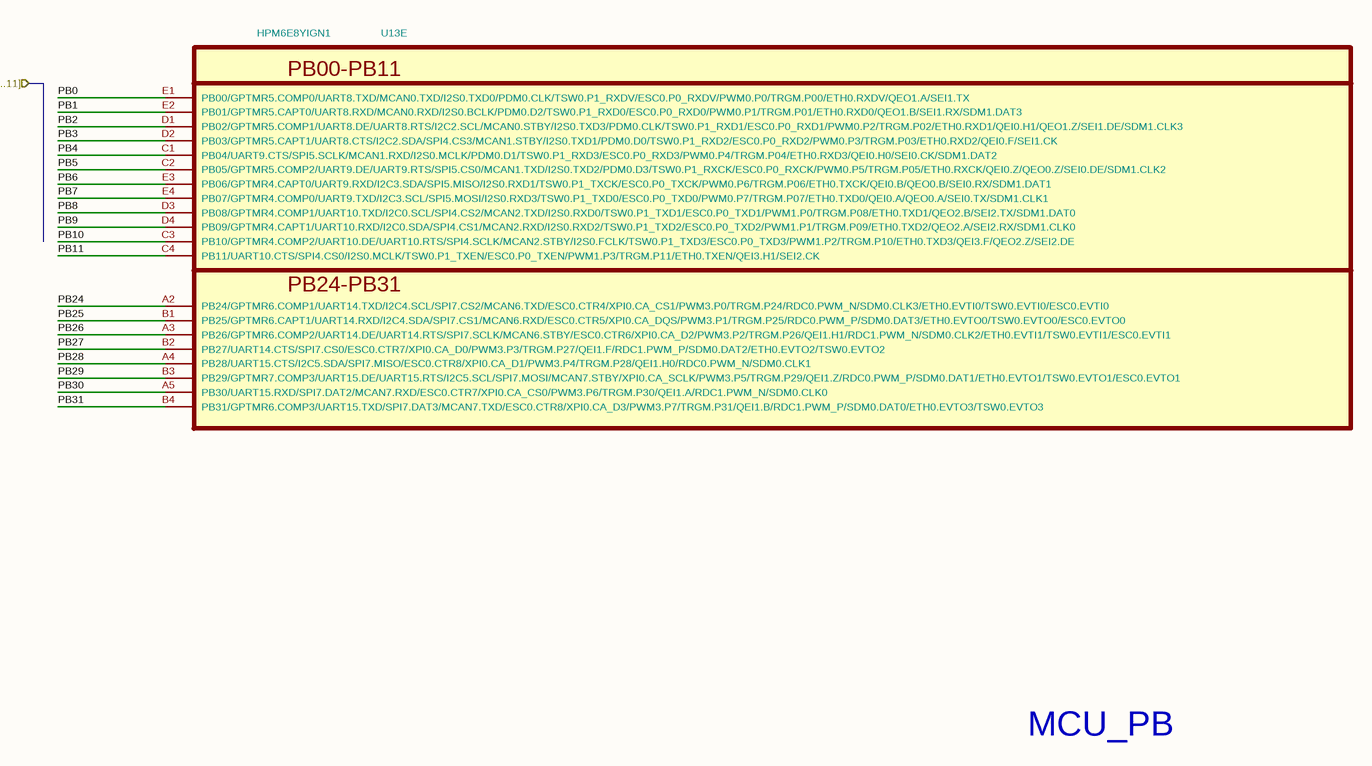
[diagram p7: 04.MCU_PB.SchDoc]

### Parts
(Parts that share a designator on the sheet are numbered #1, #2 ... from top to bottom, then left to right.)
U13#1  HPM6E8YIGN1  [BGA-196_14x14_12.0x12.0mm_P0.8mm]  (part E of 10)

### Ports
PB[0..11] (in)

### Nets
PB0: U13#1.E1(PB00/GPTMR5.COMP0/UART8.TXD/MCAN0.TXD/I2S0.TXD0/PDM0.CLK/TSW0.P1_RXDV/ESC0.P0_RXDV/PWM0.P0/TRGM.P00/ETH0.RXDV/QEO1.A/SEI1.TX)
PB1: U13#1.E2(PB01/GPTMR5.CAPT0/UART8.RXD/MCAN0.RXD/I2S0.BCLK/PDM0.D2/TSW0.P1_RXD0/ESC0.P0_RXD0/PWM0.P1/TRGM.P01/ETH0.RXD0/QEO1.B/SEI1.RX/SDM1.DAT3)
PB2: U13#1.D1(PB02/GPTMR5.COMP1/UART8.DE/UART8.RTS/I2C2.SCL/MCAN0.STBY/I2S0.TXD3/PDM0.CLK/TSW0.P1_RXD1/ESC0.P0_RXD1/PWM0.P2/TRGM.P02/ETH0.RXD1/QEI0.H1/QEO1.Z/SEI1.DE/SDM1.CLK3)
PB3: U13#1.D2(PB03/GPTMR5.CAPT1/UART8.CTS/I2C2.SDA/SPI4.CS3/MCAN1.STBY/I2S0.TXD1/PDM0.D0/TSW0.P1_RXD2/ESC0.P0_RXD2/PWM0.P3/TRGM.P03/ETH0.RXD2/QEI0.F/SEI1.CK)
PB4: U13#1.C1(PB04/UART9.CTS/SPI5.SCLK/MCAN1.RXD/I2S0.MCLK/PDM0.D1/TSW0.P1_RXD3/ESC0.P0_RXD3/PWM0.P4/TRGM.P04/ETH0.RXD3/QEI0.H0/SEI0.CK/SDM1.DAT2)
PB5: U13#1.C2(PB05/GPTMR5.COMP2/UART9.DE/UART9.RTS/SPI5.CS0/MCAN1.TXD/I2S0.TXD2/PDM0.D3/TSW0.P1_RXCK/ESC0.P0_RXCK/PWM0.P5/TRGM.P05/ETH0.RXCK/QEI0.Z/QEO0.Z/SEI0.DE/SDM1.CLK2)
PB6: U13#1.E3(PB06/GPTMR4.CAPT0/UART9.RXD/I2C3.SDA/SPI5.MISO/I2S0.RXD1/TSW0.P1_TXCK/ESC0.P0_TXCK/PWM0.P6/TRGM.P06/ETH0.TXCK/QEI0.B/QEO0.B/SEI0.RX/SDM1.DAT1)
PB7: U13#1.E4(PB07/GPTMR4.COMP0/UART9.TXD/I2C3.SCL/SPI5.MOSI/I2S0.RXD3/TSW0.P1_TXD0/ESC0.P0_TXD0/PWM0.P7/TRGM.P07/ETH0.TXD0/QEI0.A/QEO0.A/SEI0.TX/SDM1.CLK1)
PB8: U13#1.D3(PB08/GPTMR4.COMP1/UART10.TXD/I2C0.SCL/SPI4.CS2/MCAN2.TXD/I2S0.RXD0/TSW0.P1_TXD1/ESC0.P0_TXD1/PWM1.P0/TRGM.P08/ETH0.TXD1/QEO2.B/SEI2.TX/SDM1.DAT0)
PB9: U13#1.D4(PB09/GPTMR4.CAPT1/UART10.RXD/I2C0.SDA/SPI4.CS1/MCAN2.RXD/I2S0.RXD2/TSW0.P1_TXD2/ESC0.P0_TXD2/PWM1.P1/TRGM.P09/ETH0.TXD2/QEO2.A/SEI2.RX/SDM1.CLK0)
PB10: U13#1.C3(PB10/GPTMR4.COMP2/UART10.DE/UART10.RTS/SPI4.SCLK/MCAN2.STBY/I2S0.FCLK/TSW0.P1_TXD3/ESC0.P0_TXD3/PWM1.P2/TRGM.P10/ETH0.TXD3/QEI3.F/QEO2.Z/SEI2.DE)
PB11: U13#1.C4(PB11/UART10.CTS/SPI4.CS0/I2S0.MCLK/TSW0.P1_TXEN/ESC0.P0_TXEN/PWM1.P3/TRGM.P11/ETH0.TXEN/QEI3.H1/SEI2.CK)
PB24: U13#1.A2(PB24/GPTMR6.COMP1/UART14.TXD/I2C4.SCL/SPI7.CS2/MCAN6.TXD/ESC0.CTR4/XPI0.CA_CS1/PWM3.P0/TRGM.P24/RDC0.PWM_N/SDM0.CLK3/ETH0.EVTI0/TSW0.EVTI0/ESC0.EVTI0)
PB25: U13#1.B1(PB25/GPTMR6.CAPT1/UART14.RXD/I2C4.SDA/SPI7.CS1/MCAN6.RXD/ESC0.CTR5/XPI0.CA_DQS/PWM3.P1/TRGM.P25/RDC0.PWM_P/SDM0.DAT3/ETH0.EVTO0/TSW0.EVTO0/ESC0.EVTO0)
PB26: U13#1.A3(PB26/GPTMR6.COMP2/UART14.DE/UART14.RTS/SPI7.SCLK/MCAN6.STBY/ESC0.CTR6/XPI0.CA_D2/PWM3.P2/TRGM.P26/QEI1.H1/RDC1.PWM_N/SDM0.CLK2/ETH0.EVTI1/TSW0.EVTI1/ESC0.EVTI1)
PB27: U13#1.B2(PB27/UART14.CTS/SPI7.CS0/ESC0.CTR7/XPI0.CA_D0/PWM3.P3/TRGM.P27/QEI1.F/RDC1.PWM_P/SDM0.DAT2/ETH0.EVTO2/TSW0.EVTO2)
PB28: U13#1.A4(PB28/UART15.CTS/I2C5.SDA/SPI7.MISO/ESC0.CTR8/XPI0.CA_D1/PWM3.P4/TRGM.P28/QEI1.H0/RDC0.PWM_N/SDM0.CLK1)
PB29: U13#1.B3(PB29/GPTMR7.COMP3/UART15.DE/UART15.RTS/I2C5.SCL/SPI7.MOSI/MCAN7.STBY/XPI0.CA_SCLK/PWM3.P5/TRGM.P29/QEI1.Z/RDC0.PWM_P/SDM0.DAT1/ETH0.EVTO1/TSW0.EVTO1/ESC0.EVTO1)
PB30: U13#1.A5(PB30/UART15.RXD/SPI7.DAT2/MCAN7.RXD/ESC0.CTR7/XPI0.CA_CS0/PWM3.P6/TRGM.P30/QEI1.A/RDC1.PWM_N/SDM0.CLK0)
PB31: U13#1.B4(PB31/GPTMR6.COMP3/UART15.TXD/SPI7.DAT3/MCAN7.TXD/ESC0.CTR8/XPI0.CA_D3/PWM3.P7/TRGM.P31/QEI1.B/RDC1.PWM_P/SDM0.DAT0/ETH0.EVTO3/TSW0.EVTO3)

### Notes on the sheet
- MCU_PB
- 1
- 2
- 3
- 4
- 5
- 6
- A
- B
- C
- D
- Title: HPM6E8Y_RbMotor_ECAT
- File: 04.MCU_PB.kicad_sch
- Sheet: /
- KiCad E.D.A.  kicad (5.1.4)-1
- Size: A4
- Date: 2023-12-28
- Rev: RevB+
- Id: 1/1
- (in symbol HPM6E8YIGN1, part E) PB00-PB11; PB24-PB31

### Library data of the parts
U13#1 = HPM6E8YIGN1: Value: HPM6E8YIGN1; Footprint: 00_HPM_Library:BGA-196_14x14_12.0x12.0mm_P0.8mm

## Sheet 01.SYS_POWER.SchDoc
size 297 x 209 mm
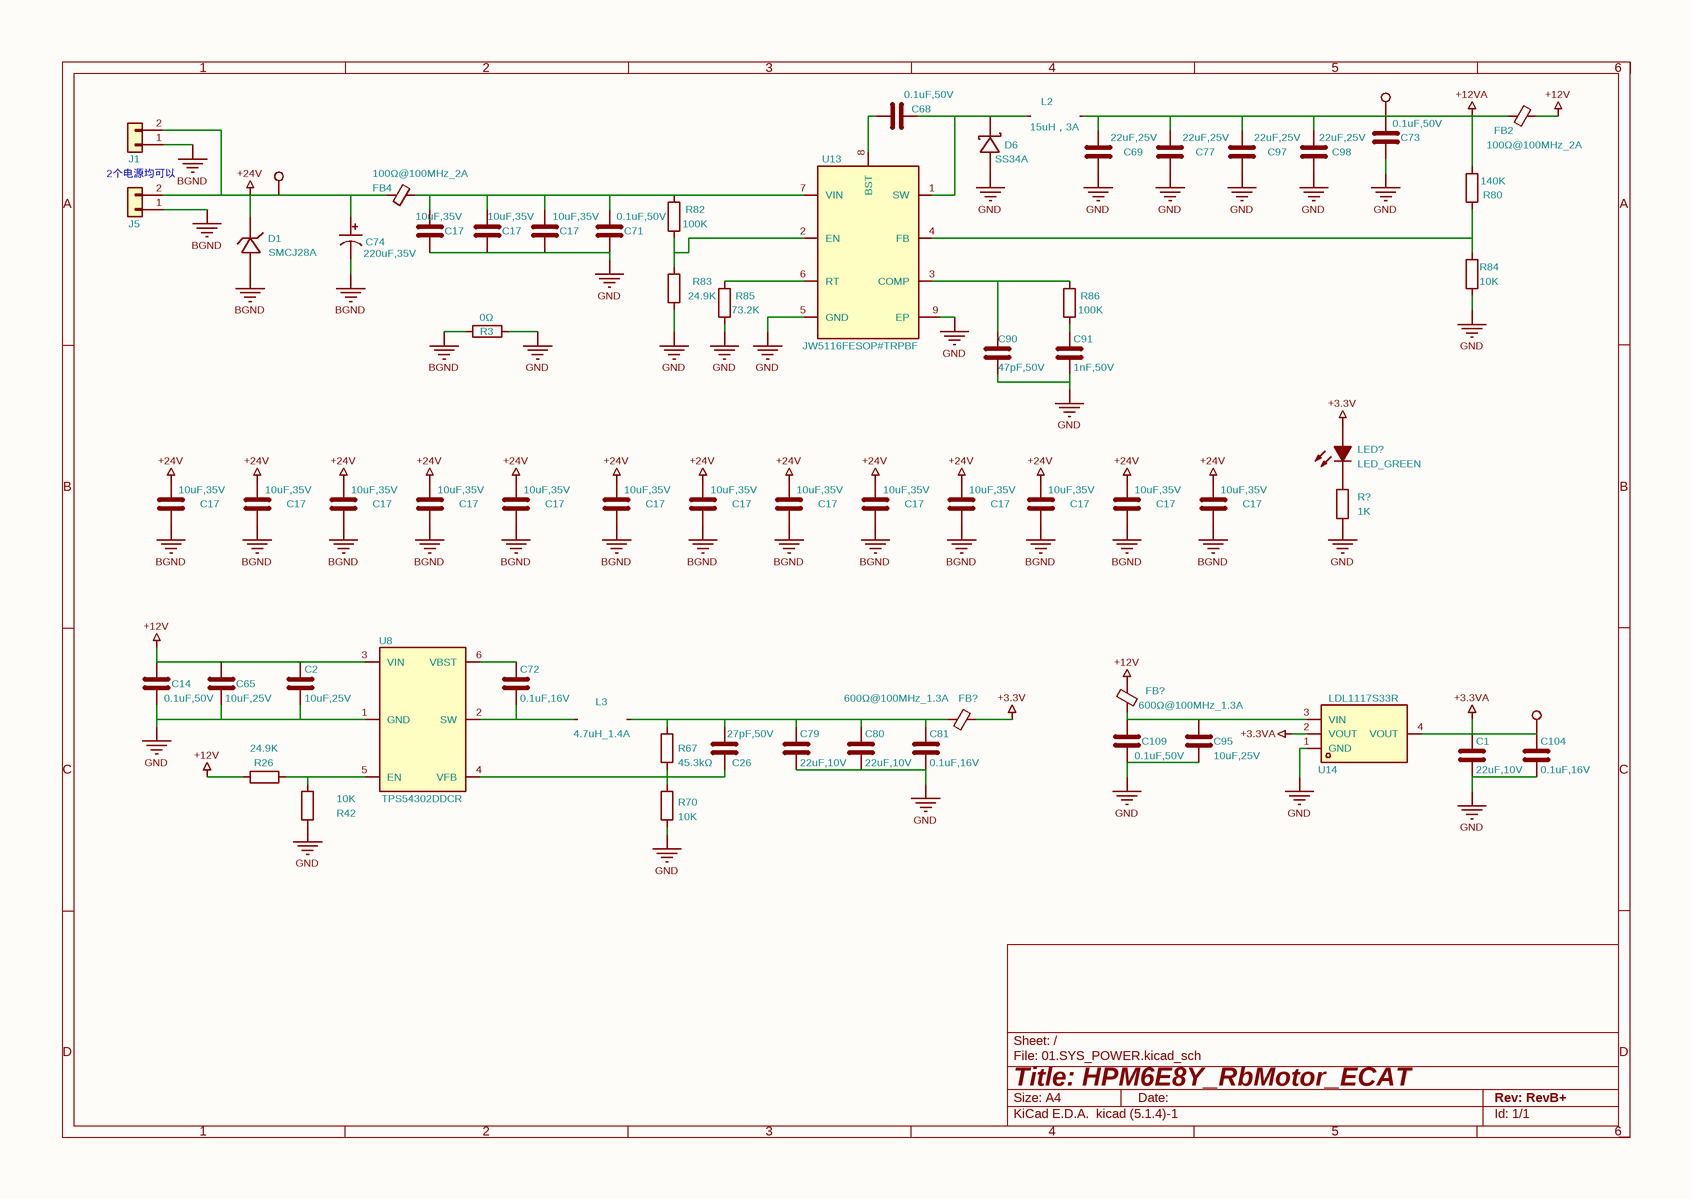
[diagram p8: 01.SYS_POWER.SchDoc]

### Parts
(Parts that share a designator on the sheet are numbered #1, #2 ... from top to bottom, then left to right.)
C1#1  22uF,10V  [C_0603_1608Metric]
C2#1  10uF,25V  [C_0603_1608Metric]
C14  0.1uF,50V  [C_0603_1608Metric]
C17#1  10uF,35V  [C_0603_1608Metric]
C17#2  10uF,35V  [C_0603_1608Metric]
C17#3  10uF,35V  [C_0603_1608Metric]
C17#4  10uF,35V  [C_0805_2012Metric]
C17#5  10uF,35V  [C_0805_2012Metric]
C17#6  10uF,35V  [C_0805_2012Metric]
C17#7  10uF,35V  [C_0805_2012Metric]
C17#8  10uF,35V  [C_0805_2012Metric]
C17#9  10uF,35V  [C_0805_2012Metric]
C17#10  10uF,35V  [C_0805_2012Metric]
C17#11  10uF,35V  [C_0805_2012Metric]
C17#12  10uF,35V  [C_0805_2012Metric]
C17#13  10uF,35V  [C_0805_2012Metric]
C17#14  10uF,35V  [C_0805_2012Metric]
C17#15  10uF,35V  [C_0805_2012Metric]
C17#16  10uF,35V  [C_0805_2012Metric]
C26#1  27pF,50V  [C_0402]
C65  10uF,25V  [C_0603_1608Metric]
C68  0.1uF,50V  [C_0402_1005Metric]
C69  22uF,25V  [C_0805_2012Metric]
C71  0.1uF,50V  [C_0402_1005Metric]
C72  0.1uF,16V  [C_0402]
C73  0.1uF,50V  [C_0402_1005Metric]
C74  220uF,35V  [CAP-SMD_BD8.0-L8.3-W8.3-LS9.1-FD]
C77  22uF,25V  [C_0805_2012Metric]
C79#1  22uF,10V  [C_0603_1608Metric]
C80#1  22uF,10V  [C_0603_1608Metric]
C81#1  0.1uF,16V  [C_0402]
C90  47pF,50V  [C_0402_1005Metric]
C91#2  1nF,50V  [C_0402_1005Metric]
C95  10uF,25V  [C_0603_1608Metric]
C97  22uF,25V  [C_0805_2012Metric]
C98  22uF,25V  [C_0805_2012Metric]
C104  0.1uF,16V  [C_0402]
C109  0.1uF,50V  [C_0603_1608Metric]
D1  SMCJ28A  [D_SMC]
D6  SS34A  [D_SMA]
FB2  100Ω@100MHz_2A  [R_0805_2012Metric]
FB4  100Ω@100MHz_2A  [R_0603_1608Metric]
FB?#1  600Ω@100MHz_1.3A  [R_0603_1608Metric]
FB?#2  600Ω@100MHz_1.3A  [R_0603_1608Metric]
J1  Conn_01x02  [XT30U 母头插座]  (value not drawn)
J5  Conn_01x02  [XT30U 母头插座]  (value not drawn)
L2  15uH，3A  [IND-SMD_L7.0-W6.6_FXL0630]
L3#1  4.7uH_1.4A  [L252010]
LED?#1  LED_GREEN  [LED_0603]
R3  0Ω  [R_0805_2012Metric]
R26  24.9K  [R_0402_1005Metric]
R42  10K  [R_0402_1005Metric]
R67  45.3kΩ  [R_0402_1005Metric]
R70  10K  [R_0402_1005Metric]
R80  140K  [R_0402_1005Metric]
R82  100K  [C_0402_1005Metric]
R83  24.9K  [C_0402_1005Metric]
R84  10K  [R_0402_1005Metric]
R85  73.2K  [C_0402_1005Metric]
R86  100K  [C_0402_1005Metric]
R?#2  1K  [R_0402_1005Metric]
TP1  0.5mm  [TestPoint_Pad_D0.5mm]  (value not drawn)
TP36  0.5mm  [TestPoint_Pad_D0.5mm]  (value not drawn)
TP40  0.5mm  [TestPoint_Pad_D0.5mm]  (value not drawn)
U8  TPS54302DDCR  [SOT-23-6]
U13#2  JW5116FESOP#TRPBF  [SOIC-8EP]
U14  LDL1117S33R  [SOT-223-4_L6.5-W3.5-P2.30-LS7.0-BR]

### Nets
+3.3V: FB?#2.1 LED?#1.2(A)
+3.3VA: C1#1.1 C104.1 TP36.1 U14.2(VOUT) U14.4(VOUT)
+12V: C2#1.1 C14.1 C65.1 FB2.1 FB?#1.1 R26.2 U8.3(VIN)
+12VA: C69.1 C73.2 C77.1 C97.1 C98.1 FB2.2 L2.2 R80.2 TP1.1
+24V: C17#4.1 C17#5.1 C17#6.1 C17#7.1 C17#8.1 C17#9.1 C17#10.1 C17#11.1 C17#12.1 C17#13.1 C17#14.1 C17#15.1 C17#16.1 C74.1 D1.1(C) FB4.2 J1.2(Pin_2) J5.2(Pin_2) TP40.1
BGND: C17#4.2 C17#5.2 C17#6.2 C17#7.2 C17#8.2 C17#9.2 C17#10.2 C17#11.2 C17#12.2 C17#13.2 C17#14.2 C17#15.2 C17#16.2 C74.2 D1.2(A) J1.1(Pin_1) J5.1(Pin_1) R3.1
GND: C1#1.2 C2#1.2 C14.2 C17#1.2 C17#2.2 C17#3.2 C65.2 C69.2 C71.1 C73.1 C77.2 C79#1.2 C80#1.2 C81#1.2 C90.2 C91#2.2 C95.2 C97.2 C98.2 C104.2 C109.2 D6.2(A) R3.2 R42.2 R70.1 R83.1 R84.1 R85.1 R?#2.1 U8.1(GND) U13#2.5(GND) U13#2.9(EP) U14.1(GND)
NetC17#1_1: C17#1.1 C17#2.1 C17#3.1 C71.2 FB4.1 R82.2 U13#2.7(VIN)
NetC26#1_1: C26#1.1 R67.1 R70.2 U8.4(VFB)
NetC26#1_2: C26#1.2 C79#1.1 C80#1.1 C81#1.1 FB?#2.2 L3#1.2 R67.2
NetC68_1: C68.1 U13#2.8(BST)
NetC68_2: C68.2 D6.1(K) L2.1 U13#2.1(SW)
NetC72_1: C72.1 U8.6(VBST)
NetC72_2: C72.2 L3#1.1 U8.2(SW)
NetC90_1: C90.1 R86.2 U13#2.3(COMP)
NetC91#2_1: C91#2.1 R86.1
NetC95_1: C95.1 C109.1 FB?#1.2 U14.3(VIN)
NetLED?#1_1: LED?#1.1(K) R?#2.2
NetR26_1: R26.1 R42.1 U8.5(EN)
NetR80_1: R80.1 R84.2 U13#2.4(FB)
NetR82_1: R82.1 R83.2 U13#2.2(EN)
NetR85_2: R85.2 U13#2.6(RT)

### Notes on the sheet
- 2个电源均可以
- 1
- 2
- 3
- 4
- 5
- 6
- A
- B
- C
- D
- Title: HPM6E8Y_RbMotor_ECAT
- File: 01.SYS_POWER.kicad_sch
- Sheet: /
- KiCad E.D.A.  kicad (5.1.4)-1
- Size: A4
- Date:
- Rev: RevB+
- Id: 1/1

### Library data of the parts
C1#1 C79#1 C80#1 = 22uF,10V_0603: Model: CL10A226MP8NUNE; Company: SAMSUNG(三星); Value: 22uF,10V; Footprint: 03_HPM_Capacitance:C_0603_1608Metric
C2#1 C65 C95 = 10uF,16V_0603: Model: CL10A106MA8NRNC; Company: SAMSUNG(三星); Value: 10uF,25V; Footprint: 03_HPM_Capacitance:C_0603_1608Metric
C14 C68 C109 = 0.1uF,50V,0603: Model: CC0603JRX7R9BB104; Company: YAGEO; Value: 0.1uF,50V
  C14 C109: Footprint: 03_HPM_Capacitance:C_0603_1608Metric
  C68: Footprint: 03_HPM_Capacitance:C_0402_1005Metric
C17#1-C17#3 = 10uF,35V_0805: Company: muRata(村田); Value: 10uF,35V; Footprint: 03_HPM_Capacitance:C_0603_1608Metric
C17#4-C17#16 = 10uF,35V_0805: Model: GRM21BR6YA106KE43L; Company: muRata(村田); Value: 10uF,35V; Footprint: 03_HPM_Capacitance:C_0805_2012Metric
C26#1 = 27pF,50V_0402: Model: 0402CG270J500NT; Company: FH(风华); Value: 27pF,50V; Footprint: 03_HPM_Capacitance:C_0402
C69 C77 C97 C98 = 22uF,25V_0805: Model: CL21A226MAQNNNE; Company: SAMSUNG(三星); Value: 22uF,25V; Footprint: 03_HPM_Capacitance:C_0805_2012Metric
C71 C73 = 0.1uF,50V,0603: Company: YAGEO; Value: 0.1uF,50V; Footprint: 03_HPM_Capacitance:C_0402_1005Metric
C72 C81#1 C104 = 0.1uF,16V: Model: CL05B104KO5NNNC; Company: SAMSUNG(三星); Value: 0.1uF,16V; Footprint: 03_HPM_Capacitance:C_0402
C74 = 固态电容 _220uF,35V_SMD: Model: JBLM2221M035D090RTM; Company: DMBJ(振宝佳); Value: 220uF,35V; Footprint: 03_HPM_Capacitance:CAP-SMD_BD8.0-L8.3-W8.3-LS9.1-FD
C90 = 47pF,50V_0402: Model: CC0402JRNPO9BN470; Company: YAGEO(国巨); Value: 47pF,50V; Footprint: 03_HPM_Capacitance:C_0402_1005Metric
C91#2 = 1nF,50V,0603: Model: CC0603JRX7R9BB102; Company: YAGEO; Value: 1nF,50V; Footprint: 03_HPM_Capacitance:C_0402_1005Metric
D1 = SMCJ28A: Company: Littelfuse(美国力特); Model: SMCJ28A; Value: SMCJ28A; Footprint: 04_HPM_Diode:D_SMC
D6 = SS34A: Company: YANGJIE(扬杰); Model: SS34A; Value: SS34A; Footprint: 04_HPM_Diode:D_SMA
FB2 = 磁珠-100Ω@100MHz_2A_0805: Model: PZ2012U101-2R0TF; Company: Sunlord(顺络); Value: 100Ω@100MHz_2A; Footprint: 02_HPM_Resistor:R_0805_2012Metric
FB4 = 磁珠-100Ω@100MHz_2A_0603: Model: PZ1608D101-2R0TF; Company: Sunlord(顺络); Value: 100Ω@100MHz_2A; Footprint: 02_HPM_Resistor:R_0603_1608Metric
FB?#1 FB?#2 = 磁珠-600Ω@100MHz_1.3A_0603: Model: BLM18KG601SN1D; Company: muRata(村田); Value: 600Ω@100MHz_1.3A; Footprint: 02_HPM_Resistor:R_0603_1608Metric
J1 J5 = Conn_01x02: Model: XT30UPB-M 公头 PCB焊板; Value: Conn_01x02; Footprint: 13_ower:XT30U 母头插座
L2 = 15uH，3A: Model: FXL0630-150-M; Company: cjiang(长江微电); Value: 15uH，3A; Footprint: 07_HPM_Inductance:IND-SMD_L7.0-W6.6_FXL0630
L3#1 = 4.7uH_1.4A: Model: DFE252010F-4R7M; Company: muRata(村田); Value: 4.7uH_1.4A; Footprint: 07_HPM_Inductance:L252010
LED?#1 = LED_GREEN: Model: NCD0603C1; Company: 国星光电; Value: LED_GREEN; Footprint: 01_HPM_Peripheral:LED_0603
R3 = 0Ω_0805: Model: RS-05000JT; Company: FH(风华); Value: 0Ω; Footprint: 02_HPM_Resistor:R_0805_2012Metric
R26 = 24.9K_0603: Company: UNI-ROYAL(厚声); Value: 24.9K; Footprint: 02_HPM_Resistor:R_0402_1005Metric
R42 R70 = 10K: Model: 0402WGF1002TCE; Company: UNI-ROYAL(厚声); Value: 10K; Footprint: 02_HPM_Resistor:R_0402_1005Metric
R67 = 100K: Model: 0402WGF4532TCE; Company: UNI-ROYAL(厚声); Value: 45.3kΩ; Footprint: 02_HPM_Resistor:R_0402_1005Metric
R80 = 140K_0402: Model: 0402WGF1403TCE; Company: UNI-ROYAL(厚声); Value: 140K; Footprint: 02_HPM_Resistor:R_0402_1005Metric
R82 = 100K: Model: 0603WAF1003T5E; Company: UNI-ROYAL(厚声); Value: 100K; Footprint: 03_HPM_Capacitance:C_0402_1005Metric
R83 = 24.9K_0603: Model: 0603WAF2492T5E; Company: UNI-ROYAL(厚声); Value: 24.9K; Footprint: 03_HPM_Capacitance:C_0402_1005Metric
R84 = 10K_0402: as R43 on sheet 00. MAIN; Value: 10K; Footprint: 02_HPM_Resistor:R_0402_1005Metric
R85 = 100K: Model: 0402WGF7322TCE; Company: UNI-ROYAL(厚声); Value: 73.2K; Footprint: 03_HPM_Capacitance:C_0402_1005Metric
R86 = 100K: Model: 0402WGF1003TCE; Company: UNI-ROYAL(厚声); Value: 100K; Footprint: 03_HPM_Capacitance:C_0402_1005Metric
R?#2 = 1K_0402: Model: 0402WGF1001TCE; Company: UNI-ROYAL(厚声); Value: 1K; Footprint: 02_HPM_Resistor:R_0402_1005Metric
TP1 TP36 TP40 = TestPoint-0.5mm: Value: 0.5mm; Footprint: 01_HPM_Peripheral:TestPoint_Pad_D0.5mm
U8 = TPS564201DDCR: Company: TI; Model: TPS54302DDCR; Value: TPS54302DDCR; Footprint: 06_HPM_SOT:SOT-23-6
U13#2 = JW5116FESOP#TRPBF: Company: Joulwatt(杰华特); Model: JW5116FESOP#TRPBF; Value: JW5116FESOP#TRPBF; Footprint: 06_HPM_SO:SOIC-8EP
U14 = LDL1117S33R: Company: ST(意法半导体); Model: LDL1117S33R; Value: LDL1117S33R; Footprint: 06_HPM_SOT:SOT-223-4_L6.5-W3.5-P2.30-LS7.0-BR

## Sheet 15.EEROM.SchDoc
size 297 x 209 mm
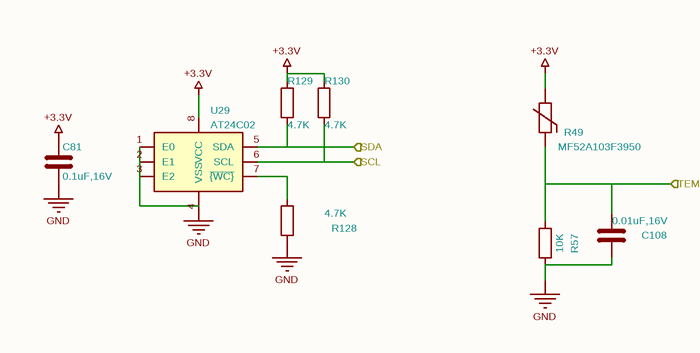
[diagram p9: 15.EEROM.SchDoc]

### Parts
(Parts that share a designator on the sheet are numbered #1, #2 ... from top to bottom, then left to right.)
C81#2  0.1uF,16V  [C_0402]
C108  0.01uF,16V  [C_0402_1005Metric]
R49  MF52A103F3950  [RES-TH_L2.5-W2.5-P1.70-D0.3]
R57  10K  [R_0402_1005Metric]
R128  4.7K  [R_0402_1005Metric]
R129  4.7K  [R_0402_1005Metric]
R130  4.7K  [R_0402_1005Metric]
U29  AT24C02  [SOIC-8]

### Ports
SCL (in), SDA (in), TEMP (in)

### Nets
+3.3V: C81#2.1 R49.2 R129.2 R130.2 U29.8(VCC)
GND: C81#2.2 C108.2 R57.1 R128.2 U29.1(E0) U29.2(E1) U29.3(E2) U29.4(VSS)
SCL: R130.1 U29.6(SCL) ; port SCL
SDA: R129.1 U29.5(SDA) ; port SDA
TEMP: C108.1 R49.1 R57.2 ; port TEMP
NetR128_1: R128.1 U29.7(~{{WC}})

### Notes on the sheet
- 1
- 2
- 3
- 4
- 5
- 6
- A
- B
- C
- D
- Title: HPM6E8Y_RbMotor_ECAT
- File: 15.EEROM.kicad_sch
- Sheet: /
- KiCad E.D.A.  kicad (5.1.4)-1
- Size: A4
- Date:
- Rev: RevB+
- Id: 1/1

### Library data of the parts
C81#2 = 0.1uF,16V: as C72 on sheet 01.SYS_POWER; Value: 0.1uF,16V; Footprint: 03_HPM_Capacitance:C_0402
C108 = 10nF,16V_0402: Model: CC0402KRX7R7BB103; Company: YAGEO(国巨); Value: 0.01uF,16V; Footprint: 03_HPM_Capacitance:C_0402_1005Metric
R49 = MF52A103F3950: Company: SURGING(绍鑫); SuppliersPartNumber: C5439706; Model: MF52A103F3950; Value: MF52A103F3950; Footprint: 02_HPM_Resistor:RES-TH_L2.5-W2.5-P1.70-D0.3
R57 = 10K_0402: as R43 on sheet 00. MAIN; Value: 10K; Footprint: 02_HPM_Resistor:R_0402_1005Metric
R128-R130 = 4.7K_0402: Model: 0402WGF4701TCE; Company: UNI-ROYAL(厚声); Value: 4.7K; Footprint: 02_HPM_Resistor:R_0402_1005Metric
U29 = AT24C02: Company: IDCHIP(英锐芯); Model: AT24C02; Value: AT24C02; Footprint: 06_HPM_SO:SOIC-8

## Sheet 07.MCU_PE_PF.SchDoc
size 297 x 209 mm
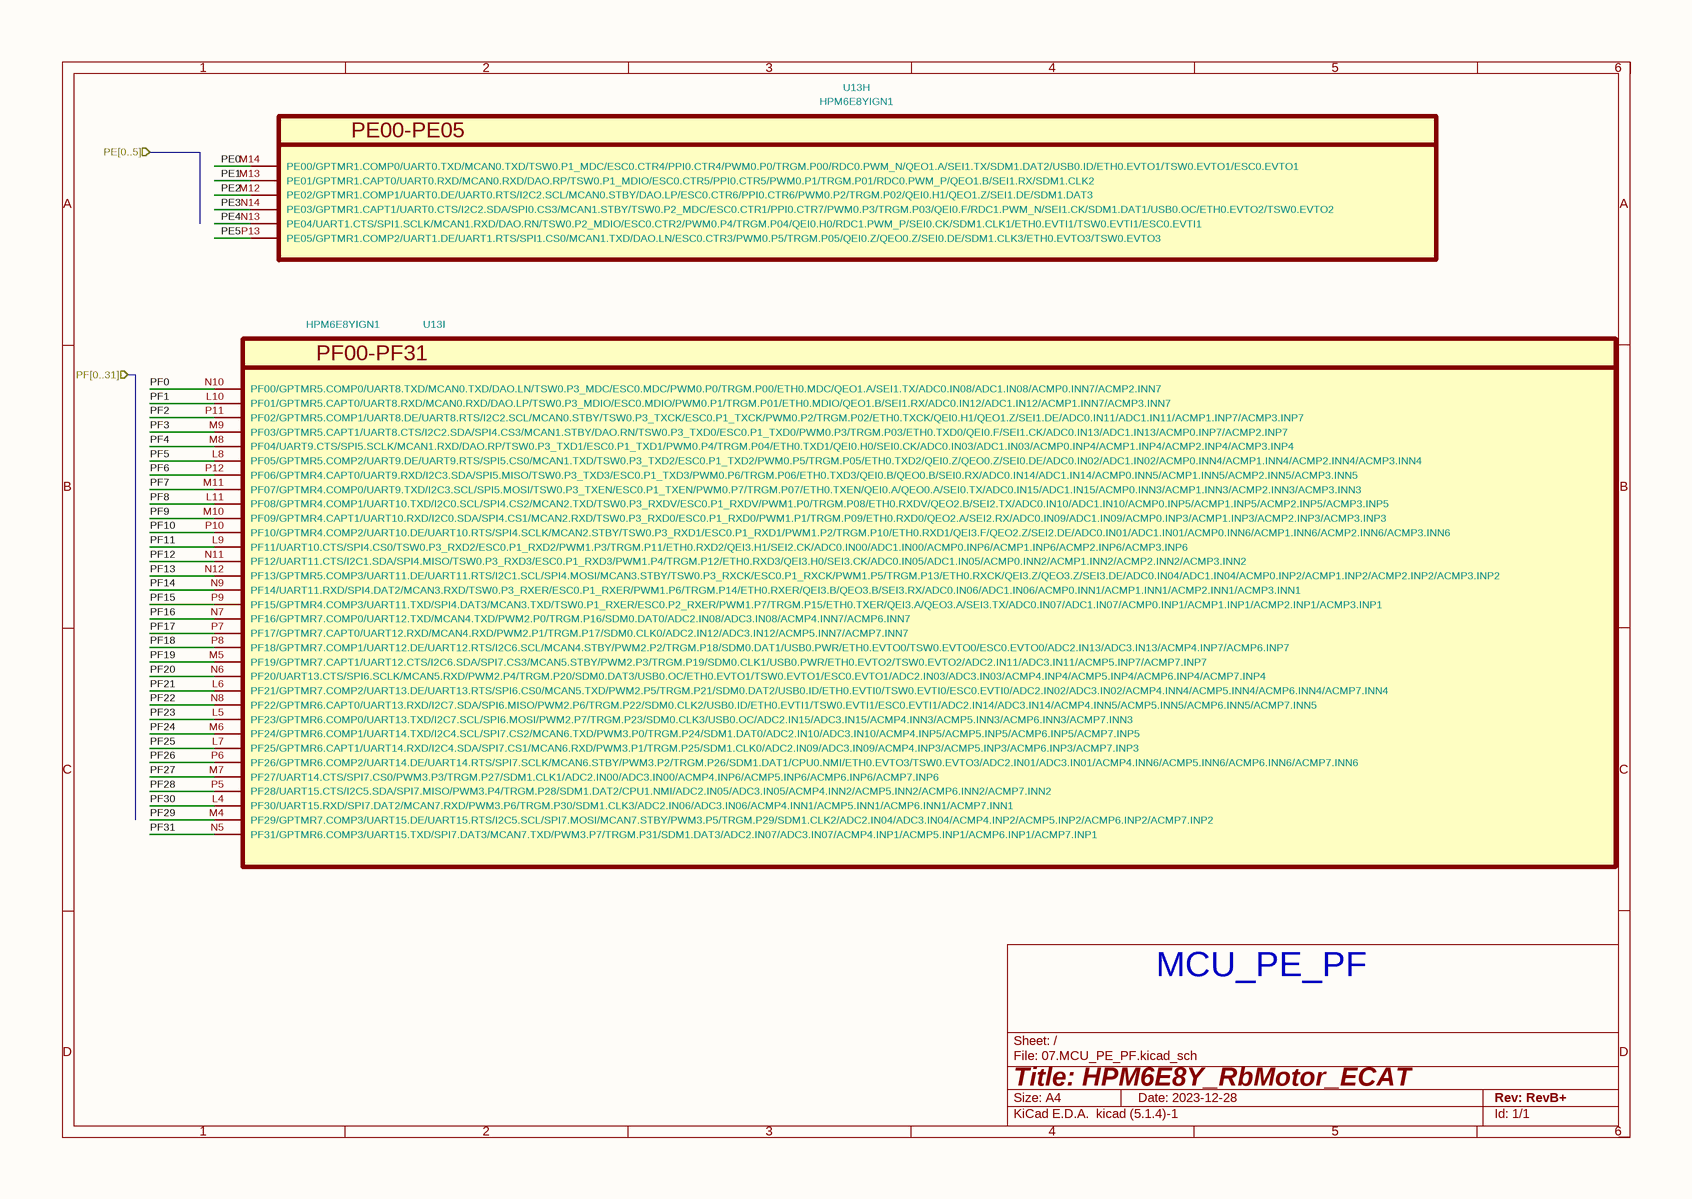
[diagram p10: 07.MCU_PE_PF.SchDoc]

### Parts
(Parts that share a designator on the sheet are numbered #1, #2 ... from top to bottom, then left to right.)
U13#1  HPM6E8YIGN1  [BGA-196_14x14_12.0x12.0mm_P0.8mm]  (parts H,I of 10)

### Ports
PE[0..5] (in), PF[0..31] (in)

### Nets
PE0: U13#1.M14(PE00/GPTMR1.COMP0/UART0.TXD/MCAN0.TXD/TSW0.P1_MDC/ESC0.CTR4/PPI0.CTR4/PWM0.P0/TRGM.P00/RDC0.PWM_N/QEO1.A/SEI1.TX/SDM1.DAT2/USB0.ID/ETH0.EVTO1/TSW0.EVTO1/ESC0.EVTO1)
PE1: U13#1.M13(PE01/GPTMR1.CAPT0/UART0.RXD/MCAN0.RXD/DAO.RP/TSW0.P1_MDIO/ESC0.CTR5/PPI0.CTR5/PWM0.P1/TRGM.P01/RDC0.PWM_P/QEO1.B/SEI1.RX/SDM1.CLK2)
PE2: U13#1.M12(PE02/GPTMR1.COMP1/UART0.DE/UART0.RTS/I2C2.SCL/MCAN0.STBY/DAO.LP/ESC0.CTR6/PPI0.CTR6/PWM0.P2/TRGM.P02/QEI0.H1/QEO1.Z/SEI1.DE/SDM1.DAT3)
PE3: U13#1.N14(PE03/GPTMR1.CAPT1/UART0.CTS/I2C2.SDA/SPI0.CS3/MCAN1.STBY/TSW0.P2_MDC/ESC0.CTR1/PPI0.CTR7/PWM0.P3/TRGM.P03/QEI0.F/RDC1.PWM_N/SEI1.CK/SDM1.DAT1/USB0.OC/ETH0.EVTO2/TSW0.EVTO2)
PE4: U13#1.N13(PE04/UART1.CTS/SPI1.SCLK/MCAN1.RXD/DAO.RN/TSW0.P2_MDIO/ESC0.CTR2/PWM0.P4/TRGM.P04/QEI0.H0/RDC1.PWM_P/SEI0.CK/SDM1.CLK1/ETH0.EVTI1/TSW0.EVTI1/ESC0.EVTI1)
PE5: U13#1.P13(PE05/GPTMR1.COMP2/UART1.DE/UART1.RTS/SPI1.CS0/MCAN1.TXD/DAO.LN/ESC0.CTR3/PWM0.P5/TRGM.P05/QEI0.Z/QEO0.Z/SEI0.DE/SDM1.CLK3/ETH0.EVTO3/TSW0.EVTO3)
PF0: U13#1.N10(PF00/GPTMR5.COMP0/UART8.TXD/MCAN0.TXD/DAO.LN/TSW0.P3_MDC/ESC0.MDC/PWM0.P0/TRGM.P00/ETH0.MDC/QEO1.A/SEI1.TX/ADC0.IN08/ADC1.IN08/ACMP0.INN7/ACMP2.INN7)
PF1: U13#1.L10(PF01/GPTMR5.CAPT0/UART8.RXD/MCAN0.RXD/DAO.LP/TSW0.P3_MDIO/ESC0.MDIO/PWM0.P1/TRGM.P01/ETH0.MDIO/QEO1.B/SEI1.RX/ADC0.IN12/ADC1.IN12/ACMP1.INN7/ACMP3.INN7)
PF2: U13#1.P11(PF02/GPTMR5.COMP1/UART8.DE/UART8.RTS/I2C2.SCL/MCAN0.STBY/TSW0.P3_TXCK/ESC0.P1_TXCK/PWM0.P2/TRGM.P02/ETH0.TXCK/QEI0.H1/QEO1.Z/SEI1.DE/ADC0.IN11/ADC1.IN11/ACMP1.INP7/ACMP3.INP7)
PF3: U13#1.M9(PF03/GPTMR5.CAPT1/UART8.CTS/I2C2.SDA/SPI4.CS3/MCAN1.STBY/DAO.RN/TSW0.P3_TXD0/ESC0.P1_TXD0/PWM0.P3/TRGM.P03/ETH0.TXD0/QEI0.F/SEI1.CK/ADC0.IN13/ADC1.IN13/ACMP0.INP7/ACMP2.INP7)
PF4: U13#1.M8(PF04/UART9.CTS/SPI5.SCLK/MCAN1.RXD/DAO.RP/TSW0.P3_TXD1/ESC0.P1_TXD1/PWM0.P4/TRGM.P04/ETH0.TXD1/QEI0.H0/SEI0.CK/ADC0.IN03/ADC1.IN03/ACMP0.INP4/ACMP1.INP4/ACMP2.INP4/ACMP3.INP4)
PF5: U13#1.L8(PF05/GPTMR5.COMP2/UART9.DE/UART9.RTS/SPI5.CS0/MCAN1.TXD/TSW0.P3_TXD2/ESC0.P1_TXD2/PWM0.P5/TRGM.P05/ETH0.TXD2/QEI0.Z/QEO0.Z/SEI0.DE/ADC0.IN02/ADC1.IN02/ACMP0.INN4/ACMP1.INN4/ACMP2.INN4/ACMP3.INN4)
PF6: U13#1.P12(PF06/GPTMR4.CAPT0/UART9.RXD/I2C3.SDA/SPI5.MISO/TSW0.P3_TXD3/ESC0.P1_TXD3/PWM0.P6/TRGM.P06/ETH0.TXD3/QEI0.B/QEO0.B/SEI0.RX/ADC0.IN14/ADC1.IN14/ACMP0.INN5/ACMP1.INN5/ACMP2.INN5/ACMP3.INN5)
PF7: U13#1.M11(PF07/GPTMR4.COMP0/UART9.TXD/I2C3.SCL/SPI5.MOSI/TSW0.P3_TXEN/ESC0.P1_TXEN/PWM0.P7/TRGM.P07/ETH0.TXEN/QEI0.A/QEO0.A/SEI0.TX/ADC0.IN15/ADC1.IN15/ACMP0.INN3/ACMP1.INN3/ACMP2.INN3/ACMP3.INN3)
PF8: U13#1.L11(PF08/GPTMR4.COMP1/UART10.TXD/I2C0.SCL/SPI4.CS2/MCAN2.TXD/TSW0.P3_RXDV/ESC0.P1_RXDV/PWM1.P0/TRGM.P08/ETH0.RXDV/QEO2.B/SEI2.TX/ADC0.IN10/ADC1.IN10/ACMP0.INP5/ACMP1.INP5/ACMP2.INP5/ACMP3.INP5)
PF9: U13#1.M10(PF09/GPTMR4.CAPT1/UART10.RXD/I2C0.SDA/SPI4.CS1/MCAN2.RXD/TSW0.P3_RXD0/ESC0.P1_RXD0/PWM1.P1/TRGM.P09/ETH0.RXD0/QEO2.A/SEI2.RX/ADC0.IN09/ADC1.IN09/ACMP0.INP3/ACMP1.INP3/ACMP2.INP3/ACMP3.INP3)
PF10: U13#1.P10(PF10/GPTMR4.COMP2/UART10.DE/UART10.RTS/SPI4.SCLK/MCAN2.STBY/TSW0.P3_RXD1/ESC0.P1_RXD1/PWM1.P2/TRGM.P10/ETH0.RXD1/QEI3.F/QEO2.Z/SEI2.DE/ADC0.IN01/ADC1.IN01/ACMP0.INN6/ACMP1.INN6/ACMP2.INN6/ACMP3.INN6)
PF11: U13#1.L9(PF11/UART10.CTS/SPI4.CS0/TSW0.P3_RXD2/ESC0.P1_RXD2/PWM1.P3/TRGM.P11/ETH0.RXD2/QEI3.H1/SEI2.CK/ADC0.IN00/ADC1.IN00/ACMP0.INP6/ACMP1.INP6/ACMP2.INP6/ACMP3.INP6)
PF12: U13#1.N11(PF12/UART11.CTS/I2C1.SDA/SPI4.MISO/TSW0.P3_RXD3/ESC0.P1_RXD3/PWM1.P4/TRGM.P12/ETH0.RXD3/QEI3.H0/SEI3.CK/ADC0.IN05/ADC1.IN05/ACMP0.INN2/ACMP1.INN2/ACMP2.INN2/ACMP3.INN2)
PF13: U13#1.N12(PF13/GPTMR5.COMP3/UART11.DE/UART11.RTS/I2C1.SCL/SPI4.MOSI/MCAN3.STBY/TSW0.P3_RXCK/ESC0.P1_RXCK/PWM1.P5/TRGM.P13/ETH0.RXCK/QEI3.Z/QEO3.Z/SEI3.DE/ADC0.IN04/ADC1.IN04/ACMP0.INP2/ACMP1.INP2/ACMP2.INP2/ACMP3.INP2)
PF14: U13#1.N9(PF14/UART11.RXD/SPI4.DAT2/MCAN3.RXD/TSW0.P3_RXER/ESC0.P1_RXER/PWM1.P6/TRGM.P14/ETH0.RXER/QEI3.B/QEO3.B/SEI3.RX/ADC0.IN06/ADC1.IN06/ACMP0.INN1/ACMP1.INN1/ACMP2.INN1/ACMP3.INN1)
PF15: U13#1.P9(PF15/GPTMR4.COMP3/UART11.TXD/SPI4.DAT3/MCAN3.TXD/TSW0.P1_RXER/ESC0.P2_RXER/PWM1.P7/TRGM.P15/ETH0.TXER/QEI3.A/QEO3.A/SEI3.TX/ADC0.IN07/ADC1.IN07/ACMP0.INP1/ACMP1.INP1/ACMP2.INP1/ACMP3.INP1)
PF16: U13#1.N7(PF16/GPTMR7.COMP0/UART12.TXD/MCAN4.TXD/PWM2.P0/TRGM.P16/SDM0.DAT0/ADC2.IN08/ADC3.IN08/ACMP4.INN7/ACMP6.INN7)
PF17: U13#1.P7(PF17/GPTMR7.CAPT0/UART12.RXD/MCAN4.RXD/PWM2.P1/TRGM.P17/SDM0.CLK0/ADC2.IN12/ADC3.IN12/ACMP5.INN7/ACMP7.INN7)
PF18: U13#1.P8(PF18/GPTMR7.COMP1/UART12.DE/UART12.RTS/I2C6.SCL/MCAN4.STBY/PWM2.P2/TRGM.P18/SDM0.DAT1/USB0.PWR/ETH0.EVTO0/TSW0.EVTO0/ESC0.EVTO0/ADC2.IN13/ADC3.IN13/ACMP4.INP7/ACMP6.INP7)
PF19: U13#1.M5(PF19/GPTMR7.CAPT1/UART12.CTS/I2C6.SDA/SPI7.CS3/MCAN5.STBY/PWM2.P3/TRGM.P19/SDM0.CLK1/USB0.PWR/ETH0.EVTO2/TSW0.EVTO2/ADC2.IN11/ADC3.IN11/ACMP5.INP7/ACMP7.INP7)
PF20: U13#1.N6(PF20/UART13.CTS/SPI6.SCLK/MCAN5.RXD/PWM2.P4/TRGM.P20/SDM0.DAT3/USB0.OC/ETH0.EVTO1/TSW0.EVTO1/ESC0.EVTO1/ADC2.IN03/ADC3.IN03/ACMP4.INP4/ACMP5.INP4/ACMP6.INP4/ACMP7.INP4)
PF21: U13#1.L6(PF21/GPTMR7.COMP2/UART13.DE/UART13.RTS/SPI6.CS0/MCAN5.TXD/PWM2.P5/TRGM.P21/SDM0.DAT2/USB0.ID/ETH0.EVTI0/TSW0.EVTI0/ESC0.EVTI0/ADC2.IN02/ADC3.IN02/ACMP4.INN4/ACMP5.INN4/ACMP6.INN4/ACMP7.INN4)
PF22: U13#1.N8(PF22/GPTMR6.CAPT0/UART13.RXD/I2C7.SDA/SPI6.MISO/PWM2.P6/TRGM.P22/SDM0.CLK2/USB0.ID/ETH0.EVTI1/TSW0.EVTI1/ESC0.EVTI1/ADC2.IN14/ADC3.IN14/ACMP4.INN5/ACMP5.INN5/ACMP6.INN5/ACMP7.INN5)
PF23: U13#1.L5(PF23/GPTMR6.COMP0/UART13.TXD/I2C7.SCL/SPI6.MOSI/PWM2.P7/TRGM.P23/SDM0.CLK3/USB0.OC/ADC2.IN15/ADC3.IN15/ACMP4.INN3/ACMP5.INN3/ACMP6.INN3/ACMP7.INN3)
PF24: U13#1.M6(PF24/GPTMR6.COMP1/UART14.TXD/I2C4.SCL/SPI7.CS2/MCAN6.TXD/PWM3.P0/TRGM.P24/SDM1.DAT0/ADC2.IN10/ADC3.IN10/ACMP4.INP5/ACMP5.INP5/ACMP6.INP5/ACMP7.INP5)
PF25: U13#1.L7(PF25/GPTMR6.CAPT1/UART14.RXD/I2C4.SDA/SPI7.CS1/MCAN6.RXD/PWM3.P1/TRGM.P25/SDM1.CLK0/ADC2.IN09/ADC3.IN09/ACMP4.INP3/ACMP5.INP3/ACMP6.INP3/ACMP7.INP3)
PF26: U13#1.P6(PF26/GPTMR6.COMP2/UART14.DE/UART14.RTS/SPI7.SCLK/MCAN6.STBY/PWM3.P2/TRGM.P26/SDM1.DAT1/CPU0.NMI/ETH0.EVTO3/TSW0.EVTO3/ADC2.IN01/ADC3.IN01/ACMP4.INN6/ACMP5.INN6/ACMP6.INN6/ACMP7.INN6)
PF27: U13#1.M7(PF27/UART14.CTS/SPI7.CS0/PWM3.P3/TRGM.P27/SDM1.CLK1/ADC2.IN00/ADC3.IN00/ACMP4.INP6/ACMP5.INP6/ACMP6.INP6/ACMP7.INP6)
PF28: U13#1.P5(PF28/UART15.CTS/I2C5.SDA/SPI7.MISO/PWM3.P4/TRGM.P28/SDM1.DAT2/CPU1.NMI/ADC2.IN05/ADC3.IN05/ACMP4.INN2/ACMP5.INN2/ACMP6.INN2/ACMP7.INN2)
PF29: U13#1.M4(PF29/GPTMR7.COMP3/UART15.DE/UART15.RTS/I2C5.SCL/SPI7.MOSI/MCAN7.STBY/PWM3.P5/TRGM.P29/SDM1.CLK2/ADC2.IN04/ADC3.IN04/ACMP4.INP2/ACMP5.INP2/ACMP6.INP2/ACMP7.INP2)
PF30: U13#1.L4(PF30/UART15.RXD/SPI7.DAT2/MCAN7.RXD/PWM3.P6/TRGM.P30/SDM1.CLK3/ADC2.IN06/ADC3.IN06/ACMP4.INN1/ACMP5.INN1/ACMP6.INN1/ACMP7.INN1)
PF31: U13#1.N5(PF31/GPTMR6.COMP3/UART15.TXD/SPI7.DAT3/MCAN7.TXD/PWM3.P7/TRGM.P31/SDM1.DAT3/ADC2.IN07/ADC3.IN07/ACMP4.INP1/ACMP5.INP1/ACMP6.INP1/ACMP7.INP1)

### Notes on the sheet
- MCU_PE_PF
- 1
- 2
- 3
- 4
- 5
- 6
- A
- B
- C
- D
- Title: HPM6E8Y_RbMotor_ECAT
- File: 07.MCU_PE_PF.kicad_sch
- Sheet: /
- KiCad E.D.A.  kicad (5.1.4)-1
- Size: A4
- Date: 2023-12-28
- Rev: RevB+
- Id: 1/1
- (in symbol HPM6E8YIGN1, part H) PE00-PE05
- (in symbol HPM6E8YIGN1, part I) PF00-PF31

### Library data of the parts
U13#1 = HPM6E8YIGN1: Value: HPM6E8YIGN1; Footprint: 00_HPM_Library:BGA-196_14x14_12.0x12.0mm_P0.8mm

## Sheet 05.MCU_PC.SchDoc
size 297 x 209 mm
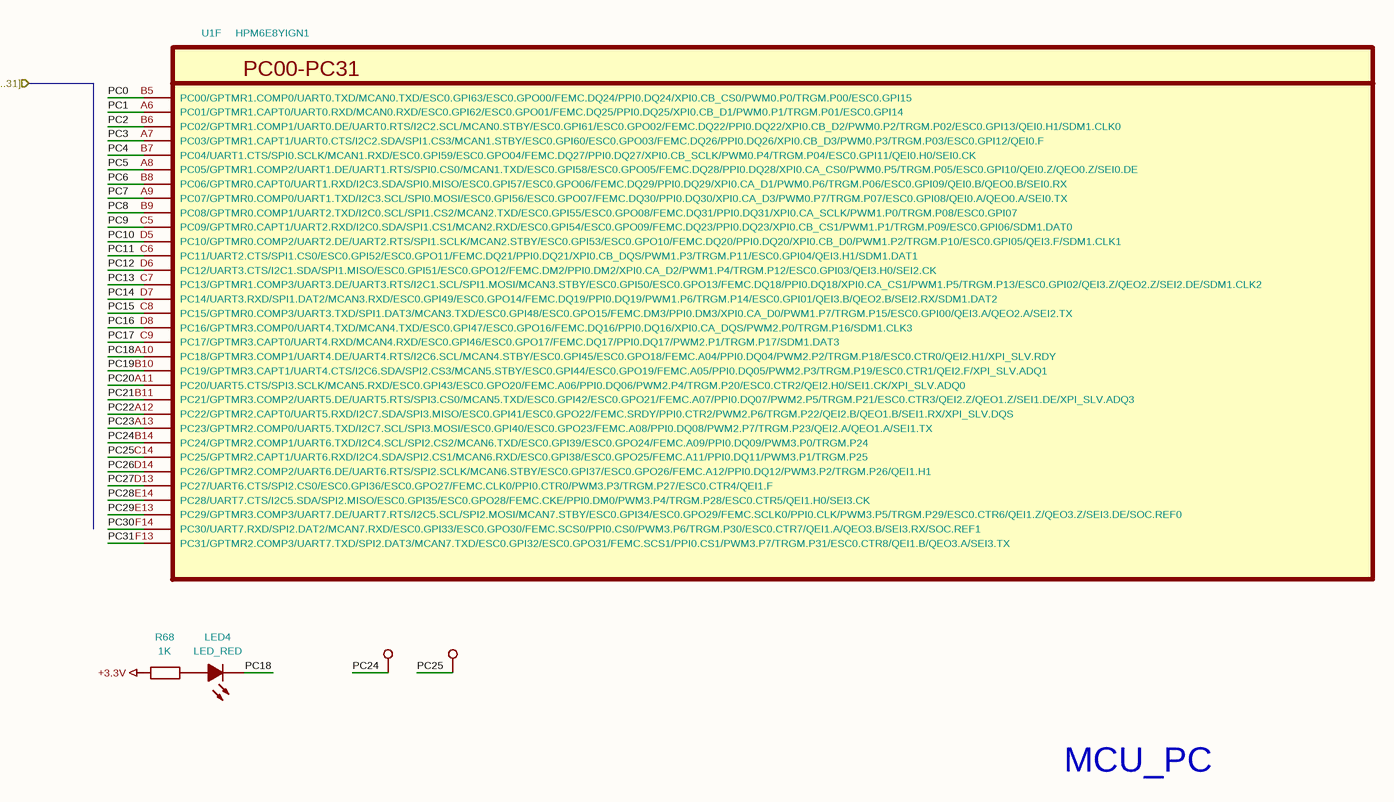
[diagram p11: 05.MCU_PC.SchDoc]

### Parts
LED4  LED_RED  [LED_0603]
R68  1K  [R_0402_1005Metric]
TP33  0.5mm  [TestPoint_Pad_D0.5mm]  (value not drawn)
TP35  0.5mm  [TestPoint_Pad_D0.5mm]  (value not drawn)
U1  HPM6E8YIGN1  [BGA-196_14x14_12.0x12.0mm_P0.8mm]  (part F of 10)

### Ports
PC[0..31] (in)

### Nets
+3.3V: R68.1
PC0: U1.B5(PC00/GPTMR1.COMP0/UART0.TXD/MCAN0.TXD/ESC0.GPI63/ESC0.GPO00/FEMC.DQ24/PPI0.DQ24/XPI0.CB_CS0/PWM0.P0/TRGM.P00/ESC0.GPI15)
PC1: U1.A6(PC01/GPTMR1.CAPT0/UART0.RXD/MCAN0.RXD/ESC0.GPI62/ESC0.GPO01/FEMC.DQ25/PPI0.DQ25/XPI0.CB_D1/PWM0.P1/TRGM.P01/ESC0.GPI14)
PC2: U1.B6(PC02/GPTMR1.COMP1/UART0.DE/UART0.RTS/I2C2.SCL/MCAN0.STBY/ESC0.GPI61/ESC0.GPO02/FEMC.DQ22/PPI0.DQ22/XPI0.CB_D2/PWM0.P2/TRGM.P02/ESC0.GPI13/QEI0.H1/SDM1.CLK0)
PC3: U1.A7(PC03/GPTMR1.CAPT1/UART0.CTS/I2C2.SDA/SPI1.CS3/MCAN1.STBY/ESC0.GPI60/ESC0.GPO03/FEMC.DQ26/PPI0.DQ26/XPI0.CB_D3/PWM0.P3/TRGM.P03/ESC0.GPI12/QEI0.F)
PC4: U1.B7(PC04/UART1.CTS/SPI0.SCLK/MCAN1.RXD/ESC0.GPI59/ESC0.GPO04/FEMC.DQ27/PPI0.DQ27/XPI0.CB_SCLK/PWM0.P4/TRGM.P04/ESC0.GPI11/QEI0.H0/SEI0.CK)
PC5: U1.A8(PC05/GPTMR1.COMP2/UART1.DE/UART1.RTS/SPI0.CS0/MCAN1.TXD/ESC0.GPI58/ESC0.GPO05/FEMC.DQ28/PPI0.DQ28/XPI0.CA_CS0/PWM0.P5/TRGM.P05/ESC0.GPI10/QEI0.Z/QEO0.Z/SEI0.DE)
PC6: U1.B8(PC06/GPTMR0.CAPT0/UART1.RXD/I2C3.SDA/SPI0.MISO/ESC0.GPI57/ESC0.GPO06/FEMC.DQ29/PPI0.DQ29/XPI0.CA_D1/PWM0.P6/TRGM.P06/ESC0.GPI09/QEI0.B/QEO0.B/SEI0.RX)
PC7: U1.A9(PC07/GPTMR0.COMP0/UART1.TXD/I2C3.SCL/SPI0.MOSI/ESC0.GPI56/ESC0.GPO07/FEMC.DQ30/PPI0.DQ30/XPI0.CA_D3/PWM0.P7/TRGM.P07/ESC0.GPI08/QEI0.A/QEO0.A/SEI0.TX)
PC8: U1.B9(PC08/GPTMR0.COMP1/UART2.TXD/I2C0.SCL/SPI1.CS2/MCAN2.TXD/ESC0.GPI55/ESC0.GPO08/FEMC.DQ31/PPI0.DQ31/XPI0.CA_SCLK/PWM1.P0/TRGM.P08/ESC0.GPI07)
PC9: U1.C5(PC09/GPTMR0.CAPT1/UART2.RXD/I2C0.SDA/SPI1.CS1/MCAN2.RXD/ESC0.GPI54/ESC0.GPO09/FEMC.DQ23/PPI0.DQ23/XPI0.CB_CS1/PWM1.P1/TRGM.P09/ESC0.GPI06/SDM1.DAT0)
PC10: U1.D5(PC10/GPTMR0.COMP2/UART2.DE/UART2.RTS/SPI1.SCLK/MCAN2.STBY/ESC0.GPI53/ESC0.GPO10/FEMC.DQ20/PPI0.DQ20/XPI0.CB_D0/PWM1.P2/TRGM.P10/ESC0.GPI05/QEI3.F/SDM1.CLK1)
PC11: U1.C6(PC11/UART2.CTS/SPI1.CS0/ESC0.GPI52/ESC0.GPO11/FEMC.DQ21/PPI0.DQ21/XPI0.CB_DQS/PWM1.P3/TRGM.P11/ESC0.GPI04/QEI3.H1/SDM1.DAT1)
PC12: U1.D6(PC12/UART3.CTS/I2C1.SDA/SPI1.MISO/ESC0.GPI51/ESC0.GPO12/FEMC.DM2/PPI0.DM2/XPI0.CA_D2/PWM1.P4/TRGM.P12/ESC0.GPI03/QEI3.H0/SEI2.CK)
PC13: U1.C7(PC13/GPTMR1.COMP3/UART3.DE/UART3.RTS/I2C1.SCL/SPI1.MOSI/MCAN3.STBY/ESC0.GPI50/ESC0.GPO13/FEMC.DQ18/PPI0.DQ18/XPI0.CA_CS1/PWM1.P5/TRGM.P13/ESC0.GPI02/QEI3.Z/QEO2.Z/SEI2.DE/SDM1.CLK2)
PC14: U1.D7(PC14/UART3.RXD/SPI1.DAT2/MCAN3.RXD/ESC0.GPI49/ESC0.GPO14/FEMC.DQ19/PPI0.DQ19/PWM1.P6/TRGM.P14/ESC0.GPI01/QEI3.B/QEO2.B/SEI2.RX/SDM1.DAT2)
PC15: U1.C8(PC15/GPTMR0.COMP3/UART3.TXD/SPI1.DAT3/MCAN3.TXD/ESC0.GPI48/ESC0.GPO15/FEMC.DM3/PPI0.DM3/XPI0.CA_D0/PWM1.P7/TRGM.P15/ESC0.GPI00/QEI3.A/QEO2.A/SEI2.TX)
PC16: U1.D8(PC16/GPTMR3.COMP0/UART4.TXD/MCAN4.TXD/ESC0.GPI47/ESC0.GPO16/FEMC.DQ16/PPI0.DQ16/XPI0.CA_DQS/PWM2.P0/TRGM.P16/SDM1.CLK3)
PC17: U1.C9(PC17/GPTMR3.CAPT0/UART4.RXD/MCAN4.RXD/ESC0.GPI46/ESC0.GPO17/FEMC.DQ17/PPI0.DQ17/PWM2.P1/TRGM.P17/SDM1.DAT3)
PC18: LED4.1(K) U1.A10(PC18/GPTMR3.COMP1/UART4.DE/UART4.RTS/I2C6.SCL/MCAN4.STBY/ESC0.GPI45/ESC0.GPO18/FEMC.A04/PPI0.DQ04/PWM2.P2/TRGM.P18/ESC0.CTR0/QEI2.H1/XPI_SLV.RDY)
PC19: U1.B10(PC19/GPTMR3.CAPT1/UART4.CTS/I2C6.SDA/SPI2.CS3/MCAN5.STBY/ESC0.GPI44/ESC0.GPO19/FEMC.A05/PPI0.DQ05/PWM2.P3/TRGM.P19/ESC0.CTR1/QEI2.F/XPI_SLV.ADQ1)
PC20: U1.A11(PC20/UART5.CTS/SPI3.SCLK/MCAN5.RXD/ESC0.GPI43/ESC0.GPO20/FEMC.A06/PPI0.DQ06/PWM2.P4/TRGM.P20/ESC0.CTR2/QEI2.H0/SEI1.CK/XPI_SLV.ADQ0)
PC21: U1.B11(PC21/GPTMR3.COMP2/UART5.DE/UART5.RTS/SPI3.CS0/MCAN5.TXD/ESC0.GPI42/ESC0.GPO21/FEMC.A07/PPI0.DQ07/PWM2.P5/TRGM.P21/ESC0.CTR3/QEI2.Z/QEO1.Z/SEI1.DE/XPI_SLV.ADQ3)
PC22: U1.A12(PC22/GPTMR2.CAPT0/UART5.RXD/I2C7.SDA/SPI3.MISO/ESC0.GPI41/ESC0.GPO22/FEMC.SRDY/PPI0.CTR2/PWM2.P6/TRGM.P22/QEI2.B/QEO1.B/SEI1.RX/XPI_SLV.DQS)
PC23: U1.A13(PC23/GPTMR2.COMP0/UART5.TXD/I2C7.SCL/SPI3.MOSI/ESC0.GPI40/ESC0.GPO23/FEMC.A08/PPI0.DQ08/PWM2.P7/TRGM.P23/QEI2.A/QEO1.A/SEI1.TX)
PC24: TP33.1 U1.B14(PC24/GPTMR2.COMP1/UART6.TXD/I2C4.SCL/SPI2.CS2/MCAN6.TXD/ESC0.GPI39/ESC0.GPO24/FEMC.A09/PPI0.DQ09/PWM3.P0/TRGM.P24)
PC25: TP35.1 U1.C14(PC25/GPTMR2.CAPT1/UART6.RXD/I2C4.SDA/SPI2.CS1/MCAN6.RXD/ESC0.GPI38/ESC0.GPO25/FEMC.A11/PPI0.DQ11/PWM3.P1/TRGM.P25)
PC26: U1.D14(PC26/GPTMR2.COMP2/UART6.DE/UART6.RTS/SPI2.SCLK/MCAN6.STBY/ESC0.GPI37/ESC0.GPO26/FEMC.A12/PPI0.DQ12/PWM3.P2/TRGM.P26/QEI1.H1)
PC27: U1.D13(PC27/UART6.CTS/SPI2.CS0/ESC0.GPI36/ESC0.GPO27/FEMC.CLK0/PPI0.CTR0/PWM3.P3/TRGM.P27/ESC0.CTR4/QEI1.F)
PC28: U1.E14(PC28/UART7.CTS/I2C5.SDA/SPI2.MISO/ESC0.GPI35/ESC0.GPO28/FEMC.CKE/PPI0.DM0/PWM3.P4/TRGM.P28/ESC0.CTR5/QEI1.H0/SEI3.CK)
PC29: U1.E13(PC29/GPTMR3.COMP3/UART7.DE/UART7.RTS/I2C5.SCL/SPI2.MOSI/MCAN7.STBY/ESC0.GPI34/ESC0.GPO29/FEMC.SCLK0/PPI0.CLK/PWM3.P5/TRGM.P29/ESC0.CTR6/QEI1.Z/QEO3.Z/SEI3.DE/SOC.REF0)
PC30: U1.F14(PC30/UART7.RXD/SPI2.DAT2/MCAN7.RXD/ESC0.GPI33/ESC0.GPO30/FEMC.SCS0/PPI0.CS0/PWM3.P6/TRGM.P30/ESC0.CTR7/QEI1.A/QEO3.B/SEI3.RX/SOC.REF1)
PC31: U1.F13(PC31/GPTMR2.COMP3/UART7.TXD/SPI2.DAT3/MCAN7.TXD/ESC0.GPI32/ESC0.GPO31/FEMC.SCS1/PPI0.CS1/PWM3.P7/TRGM.P31/ESC0.CTR8/QEI1.B/QEO3.A/SEI3.TX)
NetLED4_2: LED4.2(A) R68.2

### Notes on the sheet
- MCU_PC
- 1
- 2
- 3
- 4
- 5
- 6
- A
- B
- C
- D
- Title: HPM6E8Y_RbMotor_ECAT
- File: 05.MCU_PC.kicad_sch
- Sheet: /
- KiCad E.D.A.  kicad (5.1.4)-1
- Size: A4
- Date: 2023-12-28
- Rev: RevB+
- Id: 1/1
- (in symbol HPM6E8YIGN1, part F) PC00-PC31

### Library data of the parts
LED4 = LED_RED: Model: NCD0603R1; Company: 国星光电; Value: LED_RED; Footprint: 01_HPM_Peripheral:LED_0603
R68 = 1K_0402: as R?#2 on sheet 01.SYS_POWER; Value: 1K; Footprint: 02_HPM_Resistor:R_0402_1005Metric
TP33 TP35 = TestPoint-0.5mm: Value: 0.5mm; Footprint: 01_HPM_Peripheral:TestPoint_Pad_D0.5mm
U1 = HPM6E8YIGN1: Value: HPM6E8YIGN1; Footprint: 00_HPM_Library:BGA-196_14x14_12.0x12.0mm_P0.8mm